# EAGLE board pipistrello_v2 (EAGLE 6.3), part 1 of 2
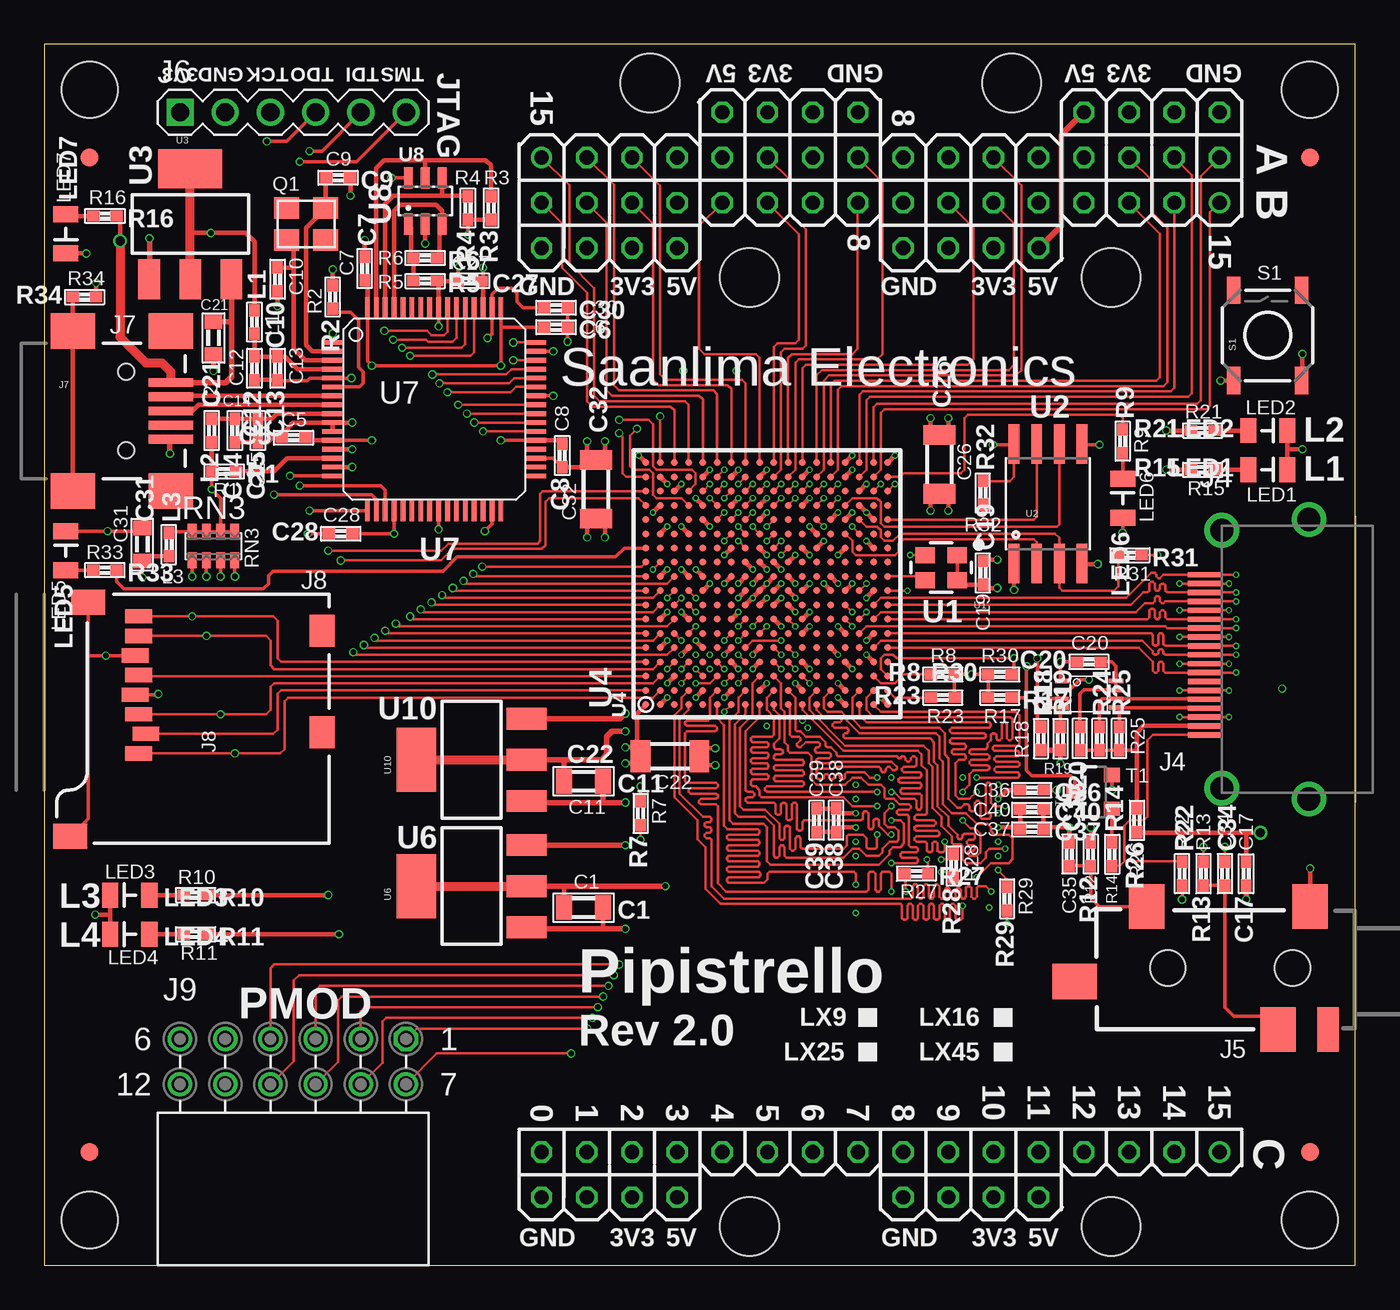
[diagram p5: board, top side]
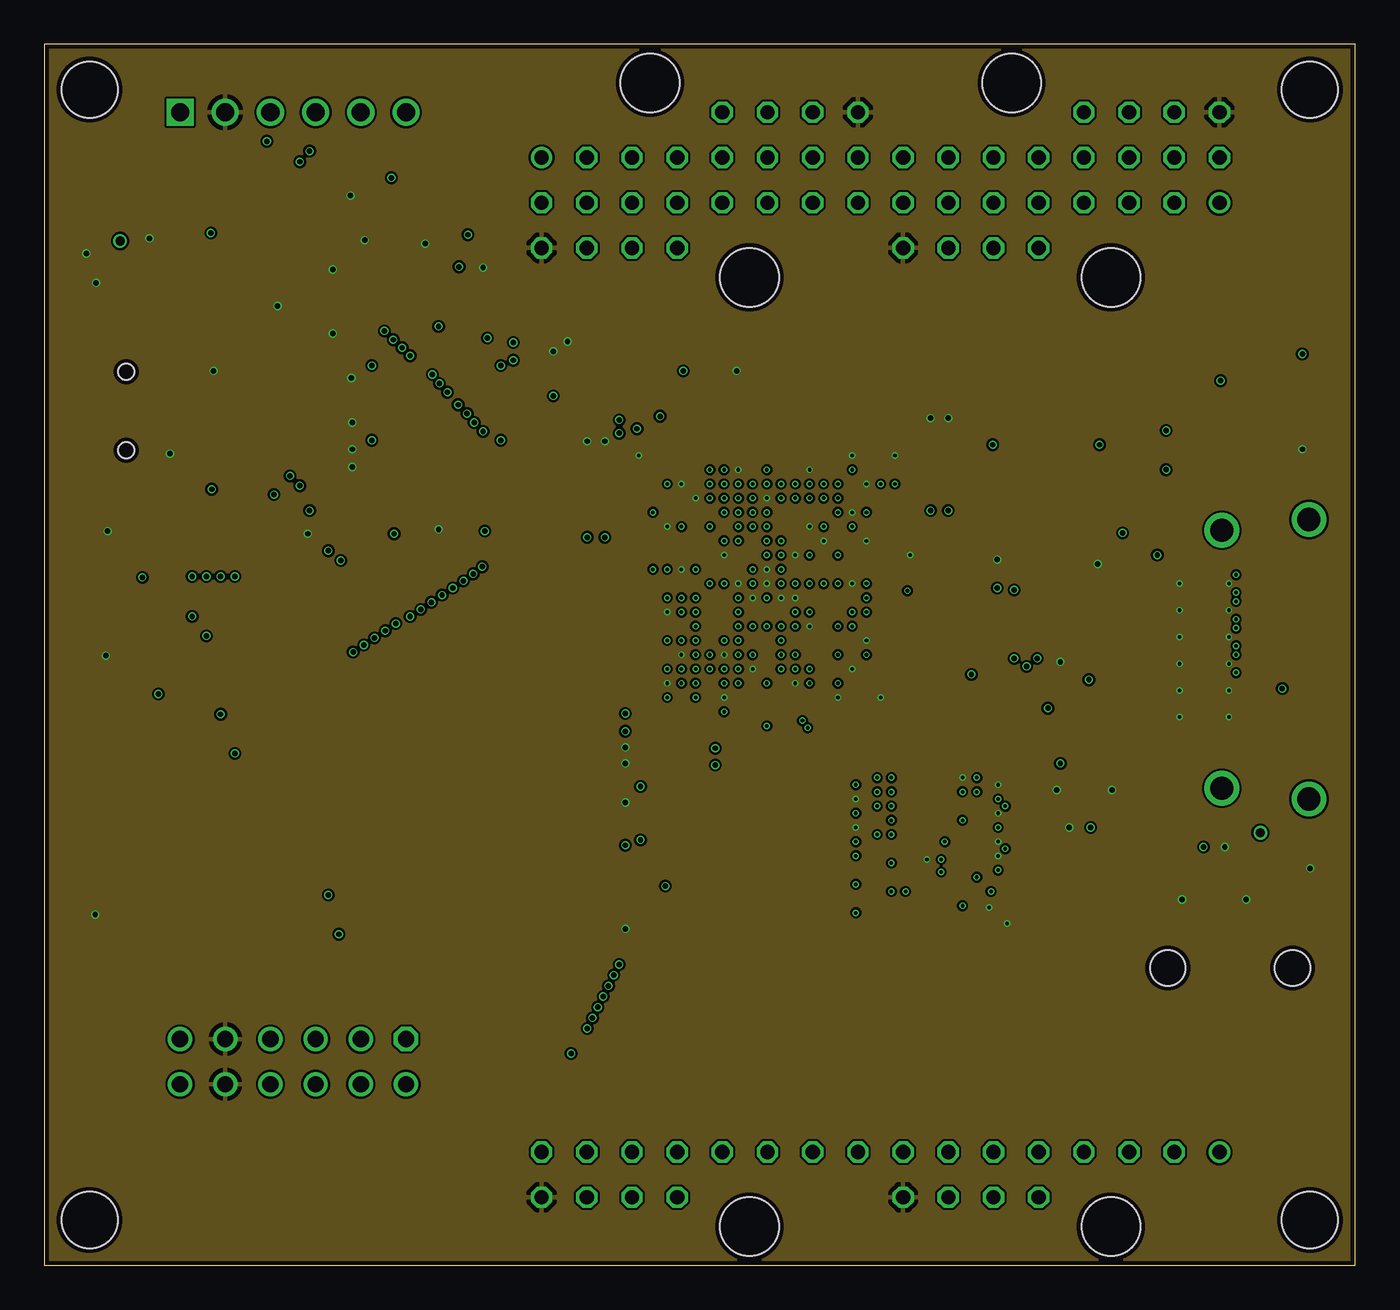
[diagram p6: board, inner layer Route2]
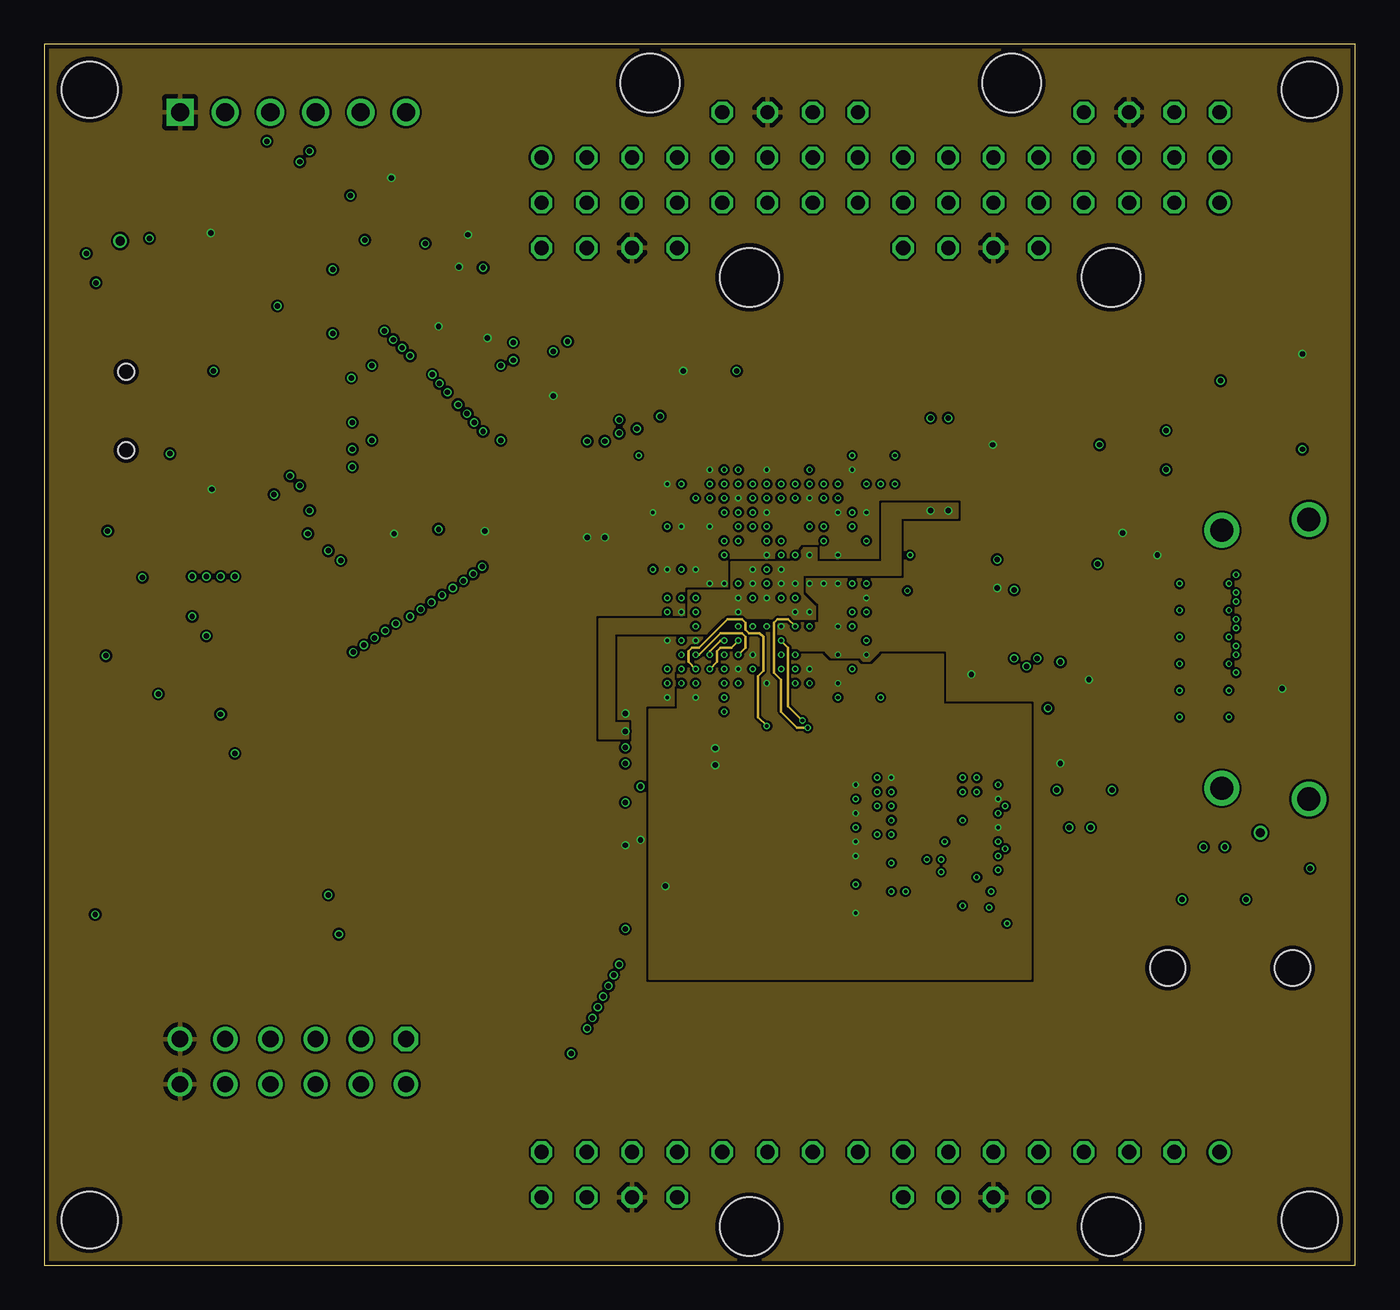
[diagram p7: board, inner layer Route3]
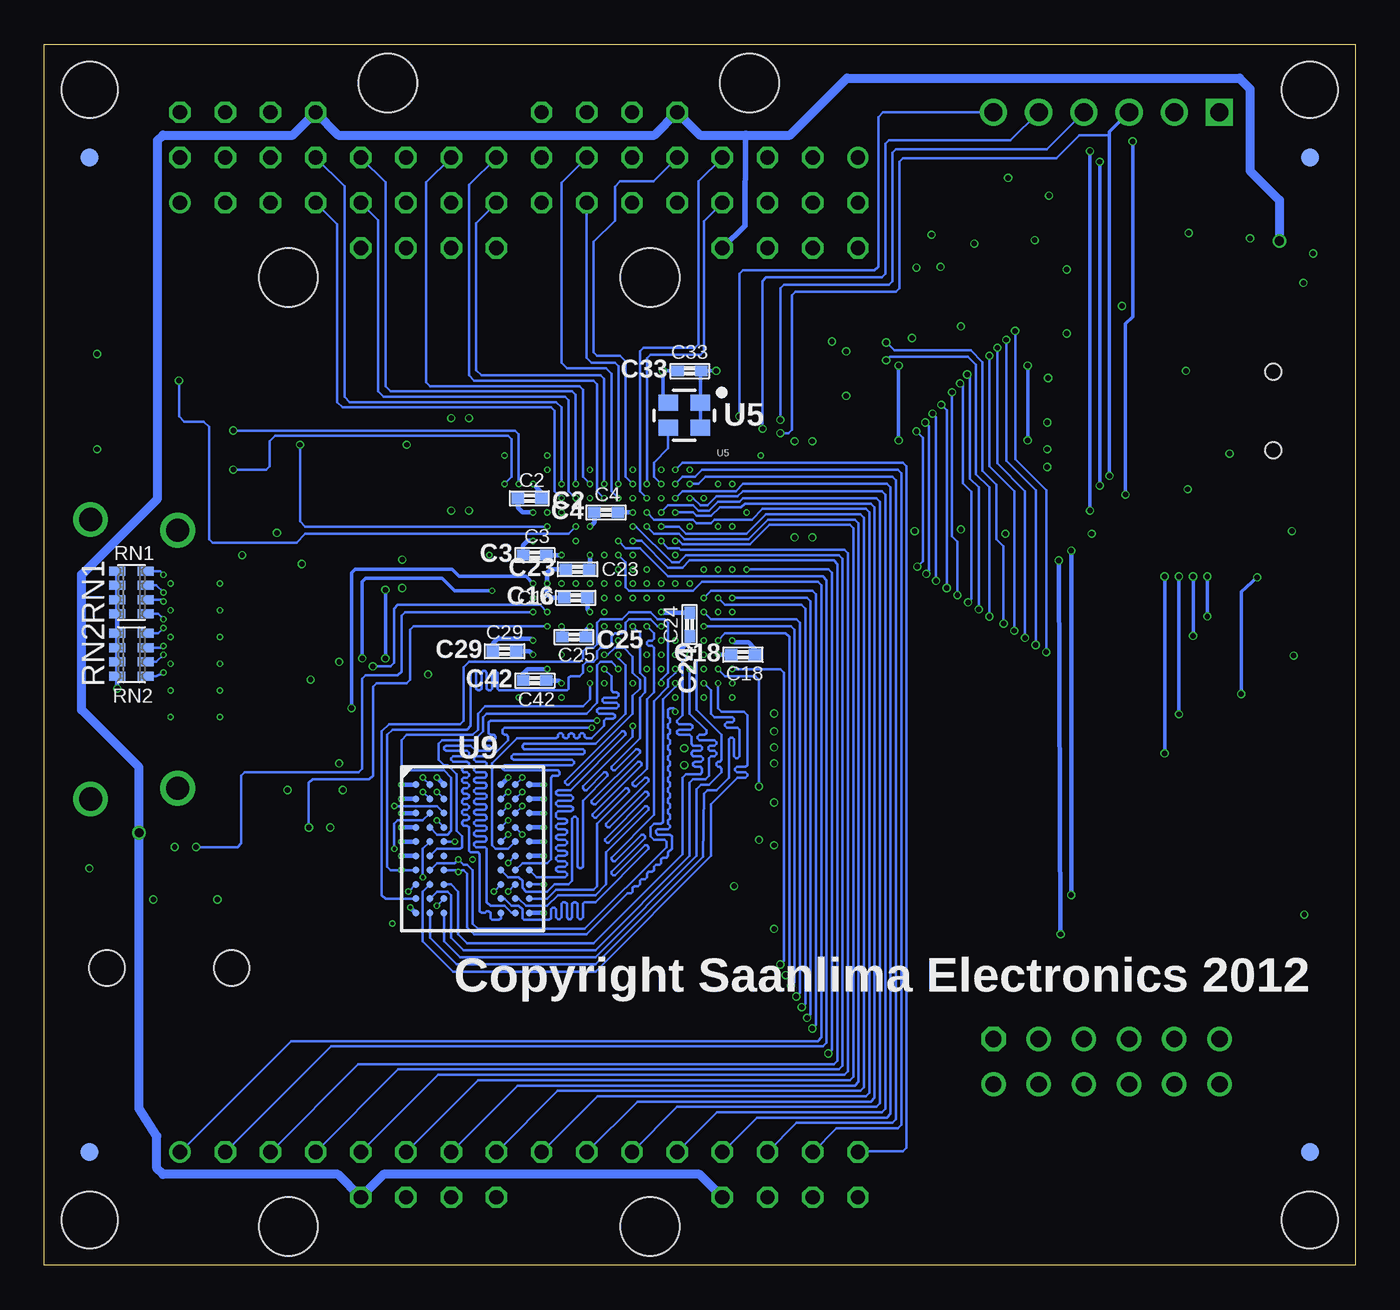
[diagram p8: board, bottom side, seen from below]

Size 73.66 x 68.58 mm. Coordinates in mm from the lower left corner, seen from the top.
Outline: 0,0 73.66,0 73.66,68.58 0,68.58 0,0
Copper layers (1*2+3*16): Top 0.035mm / dielectric 0.2mm / Route2 0.035mm / dielectric 0.05mm / Route3 0.035mm / dielectric 0.2mm / Bottom 0.035mm
Design rules "Fusion_eagle_rule_v1.1 *": minimum track width 5mil, minimum drill 8mil, track to track 5mil, track to pad 5mil, pad to pad 5mil, via to via 5mil, smd to smd 0mil, copper to edge 10mil, drill to drill 10mil, minimum pad ring 4mil, minimum via ring 3mil, stop-mask expansion 2mil, vias tented up to drill 100mil, thermal gap 10mil
Net classes: 1 power: width 0.203 mm
Holes 3.17 mm at 2.54,66.04 2.54,2.54 71.12,2.54 71.12,66.04

## Footprints (pad centres in the part's own frame; a part is rotated, then mirrored left to right if it is on the bottom)
0805 = smd 0.9 x 1.4: 1 -1.1,0; 2 1.1,0
0402 = smd 0.7 x 0.6: 1 -0.655,0; 2 0.655,0
0603 = smd 0.8 x 1: 1 -0.925,0; 2 0.925,0
1206 = smd 1.1 x 1.8: 1 -1.65,0; 2 1.65,0
WING_16BIT = drill 0.8 octagon: 1 1.27,-19.05; 2 1.27,-16.51; 2V5H 3.81,3.81; 2V5L 3.81,-16.51; 3 1.27,-13.97; 3V3H 3.81,6.35; 3V3L 3.81,-13.97; 4 1.27,-11.43; 5 1.27,-8.89; 5VH 3.81,8.89; 5VL 3.81,-11.43; 6 1.27,-6.35; 7 1.27,-3.81; 8 1.27,-1.27; 9 1.27,1.27; 10 1.27,3.81; 11 1.27,6.35; 12 1.27,8.89; 13 1.27,11.43; 14 1.27,13.97; 15 1.27,16.51; GNDH 3.81,1.27; GNDL 3.81,-19.05 | drill 0.8: 16 1.27,19.05 | hole 3.302: 5.461,12.954; 5.461,-7.366
FCI-HDMI-TYPE-A-RECEPT = smd 1.9 x 0.3: 1 -0.95,4.5; 2 -0.95,4; 3 -0.95,3.5; 4 -0.95,3; 5 -0.95,2.5; 6 -0.95,2; 7 -0.95,1.5; 8 -0.95,1; 9 -0.95,0.5; 10 -0.95,0; 11 -0.95,-0.5; 12 -0.95,-1; 13 -0.95,-1.5; 14 -0.95,-2; 15 -0.95,-2.5; 16 -0.95,-3; 17 -0.95,-3.5; 18 -0.95,-4; 19 -0.95,-4.5 | drill 1.3: SH1 4.9,7.6; SH2 0,7; SH3 0,-7.5; SH4 4.9,-8.1
AUDIO-JACK-3.5MM-SMD = smd 2 x 2.5: RING 4.3,3.45; SLEEVE 2.5,-3.45; TIP 11.7,-3.45 | smd 1.2 x 2.5: RSH 1.5,3.45 | smd 2.5 x 2: TSH 15.75,0.75 | hole 2: 3.5,0; 10.5,0
MA06-1 = drill 1.016 square: 1 0,0 | drill 1.016: 2 2.54,0; 3 5.08,0; 4 7.62,0; 5 10.16,0; 6 12.7,0
USB-MINIB = smd 2.5 x 0.5: D+ 2.5,0; D- 2.5,0.8; GND 2.5,-1.6; ID 2.5,-0.8; VBUS 2.5,1.6 | smd 2.5 x 2: MTN1 -3,4.5; MTN2 2.5,4.5; MTN3 -3,-4.5; MTN4 2.5,-4.5 | hole 0.9: 0,2.2; 0,-2.2
MICRO-SD-SOCKET-PP = smd 0.8 x 1.5: 1 -8.94,10.7; 2 -7.84,10.3; 3 -6.74,10.7; 4 -5.64,10.9; 5 -4.54,10.7; 6 -3.44,10.9; 7 -2.34,10.7; 8 -1.24,10.7 | smd 1.8 x 1.4: CD1 -2.05,0.4; CD2 -7.75,0.4 | smd 1.4 x 1.9: GND1 -13.6,14.55; GND3 -0.45,13.55
PMOD = drill 0.914 octagon: 1 6.35,1.27 | drill 0.914: 2 3.81,1.27; 3 1.27,1.27; 4 -1.27,1.27; 5 -3.81,1.27; 6 -6.35,1.27; 7 6.35,-1.27; 8 3.81,-1.27; 9 1.27,-1.27; 10 -1.27,-1.27; 11 -3.81,-1.27; 12 -6.35,-1.27
FIDUCIAL-1X2 = smd 1 x 1: 1 0,0
0805_POL = smd 0.9 x 1.4: + 1.1,0; - -1.1,0
CRYSTAL3.2X2.5MM = smd 1.4 x 1.2: 1 -1.1,-0.9; 2 1.1,-0.9; 3 1.1,0.9; 4 -1.1,0.9
CTS742C083 = smd 0.5 x 0.9: 1 -1.2,-0.8; 2 -0.4,-0.8; 3 0.4,-0.8; 4 1.2,-0.8; 5 1.2,0.8; 6 0.4,0.8; 7 -0.4,0.8; 8 -1.2,0.8
TACTILE_SWITCH_SMD = smd 1.524 x 0.762: 1 -2.54,1.905; 2 2.54,1.905; 3 -2.54,-1.905; 4 2.54,-1.905
SOT23-3 = smd 0.8 x 0.9: 1 -0.95,-1; 2 0.95,-1; 3 0,1.1
CRYSTAL-OSC-SMD-2.5X2 = smd 1.1 x 0.9: 1 -0.9,-0.7; 2 0.9,-0.7; 3 0.9,0.7; 4 -0.9,0.7
SO08-EIAJ = smd 0.61 x 2.21: 1 -1.905,-3.378; 2 -0.635,-3.378; 3 0.635,-3.378; 4 1.905,-3.378; 5 1.905,3.353; 6 0.635,3.353; 7 -0.635,3.353; 8 -1.905,3.353
SOT223 = smd 1.219 x 2.235: 1 -2.311,-3.099; 2 0,-3.099; 3 2.311,-3.099 | smd 3.6 x 2.2: 4 0,3.099
CS324 = smd 0.4 x 0.4: A1 -6.8,6.8; A2 -6,6.8; A3 -5.2,6.8; A4 -4.4,6.8; A5 -3.6,6.8; A6 -2.8,6.8; A7 -2,6.8; A8 -1.2,6.8; A9 -0.4,6.8; A10 0.4,6.8; A11 1.2,6.8; A12 2,6.8; A13 2.8,6.8; A14 3.6,6.8; A15 4.4,6.8; A16 5.2,6.8; A17 6,6.8; A18 6.8,6.8; B1 -6.8,6; B2 -6,6; B3 -5.2,6; B4 -4.4,6; B5 -3.6,6; B6 -2.8,6; B7 -2,6; B8 -1.2,6; B9 -0.4,6; B10 0.4,6; B11 1.2,6; B12 2,6; B13 2.8,6; B14 3.6,6; B15 4.4,6; B16 5.2,6; B17 6,6; B18 6.8,6; C1 -6.8,5.2; C2 -6,5.2; C3 -5.2,5.2; C4 -4.4,5.2; C5 -3.6,5.2; C6 -2.8,5.2; C7 -2,5.2; C8 -1.2,5.2; C9 -0.4,5.2; C10 0.4,5.2; C11 1.2,5.2; C12 2,5.2; C13 2.8,5.2; C14 3.6,5.2; C15 4.4,5.2; C16 5.2,5.2; C17 6,5.2; C18 6.8,5.2; D1 -6.8,4.4; D2 -6,4.4; D3 -5.2,4.4; D4 -4.4,4.4; D5 -3.6,4.4; D6 -2.8,4.4; D7 -2,4.4; D8 -1.2,4.4; D9 -0.4,4.4; D10 0.4,4.4; D11 1.2,4.4; D12 2,4.4; D13 2.8,4.4; D14 3.6,4.4; D15 4.4,4.4; D16 5.2,4.4; D17 6,4.4; D18 6.8,4.4; E1 -6.8,3.6; E2 -6,3.6; E3 -5.2,3.6; E4 -4.4,3.6; E5 -3.6,3.6; E6 -2.8,3.6; E7 -2,3.6; E8 -1.2,3.6; E9 -0.4,3.6; E10 0.4,3.6; E11 1.2,3.6; E12 2,3.6; E13 2.8,3.6; E14 3.6,3.6; E15 4.4,3.6; E16 5.2,3.6; E17 6,3.6; E18 6.8,3.6; F1 -6.8,2.8; F2 -6,2.8; F3 -5.2,2.8; F4 -4.4,2.8; F5 -3.6,2.8; F6 -2.8,2.8; F7 -2,2.8; F8 -1.2,2.8; F9 -0.4,2.8; F10 0.4,2.8; F11 1.2,2.8; F12 2,2.8; F13 2.8,2.8; F14 3.6,2.8; F15 4.4,2.8; F16 5.2,2.8; F17 6,2.8; F18 6.8,2.8; G1 -6.8,2; G2 -6,2; G3 -5.2,2; G4 -4.4,2; G5 -3.6,2; G6 -2.8,2; G7 -2,2; G8 -1.2,2; G9 -0.4,2; G10 0.4,2; G11 1.2,2; G12 2,2; G13 2.8,2; G14 3.6,2; G15 4.4,2; G16 5.2,2; G17 6,2; G18 6.8,2; H1 -6.8,1.2; H2 -6,1.2; H3 -5.2,1.2; H4 -4.4,1.2; H5 -3.6,1.2; H6 -2.8,1.2; H7 -2,1.2; H8 -1.2,1.2; H9 -0.4,1.2; H10 0.4,1.2; H11 1.2,1.2; H12 2,1.2; H13 2.8,1.2; H14 3.6,1.2; H15 4.4,1.2; H16 5.2,1.2; H17 6,1.2; H18 6.8,1.2; J1 -6.8,0.4; J2 -6,0.4; J3 -5.2,0.4; J4 -4.4,0.4; J5 -3.6,0.4; J6 -2.8,0.4; J7 -2,0.4; J8 -1.2,0.4; J9 -0.4,0.4; J10 0.4,0.4; J11 1.2,0.4; J12 2,0.4; J13 2.8,0.4; J14 3.6,0.4; J15 4.4,0.4; J16 5.2,0.4; J17 6,0.4; J18 6.8,0.4; K1 -6.8,-0.4; K2 -6,-0.4; K3 -5.2,-0.4; K4 -4.4,-0.4; K5 -3.6,-0.4; K6 -2.8,-0.4; K7 -2,-0.4; K8 -1.2,-0.4; K9 -0.4,-0.4; K10 0.4,-0.4; K11 1.2,-0.4; K12 2,-0.4; K13 2.8,-0.4; K14 3.6,-0.4; K15 4.4,-0.4; K16 5.2,-0.4; K17 6,-0.4; K18 6.8,-0.4; L1 -6.8,-1.2; L2 -6,-1.2; L3 -5.2,-1.2; L4 -4.4,-1.2; L5 -3.6,-1.2; L6 -2.8,-1.2; L7 -2,-1.2; L8 -1.2,-1.2; L9 -0.4,-1.2; L10 0.4,-1.2; L11 1.2,-1.2; L12 2,-1.2; L13 2.8,-1.2; L14 3.6,-1.2; L15 4.4,-1.2; L16 5.2,-1.2; L17 6,-1.2; L18 6.8,-1.2; M1 -6.8,-2; M2 -6,-2; M3 -5.2,-2; M4 -4.4,-2; M5 -3.6,-2; M6 -2.8,-2; M7 -2,-2; M8 -1.2,-2; M9 -0.4,-2; M10 0.4,-2; M11 1.2,-2; M12 2,-2; M13 2.8,-2; M14 3.6,-2; M15 4.4,-2; M16 5.2,-2; M17 6,-2; M18 6.8,-2; N1 -6.8,-2.8; N2 -6,-2.8; N3 -5.2,-2.8; N4 -4.4,-2.8; N5 -3.6,-2.8; N6 -2.8,-2.8; N7 -2,-2.8; N8 -1.2,-2.8; N9 -0.4,-2.8; N10 0.4,-2.8; N11 1.2,-2.8; N12 2,-2.8; N13 2.8,-2.8; N14 3.6,-2.8; N15 4.4,-2.8; N16 5.2,-2.8; N17 6,-2.8; N18 6.8,-2.8; P1 -6.8,-3.6; P2 -6,-3.6; P3 -5.2,-3.6; P4 -4.4,-3.6; P5 -3.6,-3.6; P6 -2.8,-3.6; P7 -2,-3.6; P8 -1.2,-3.6; P9 -0.4,-3.6; P10 0.4,-3.6; P11 1.2,-3.6; P12 2,-3.6; P13 2.8,-3.6; P14 3.6,-3.6; P15 4.4,-3.6; P16 5.2,-3.6; P17 6,-3.6; P18 6.8,-3.6; R1 -6.8,-4.4; R2 -6,-4.4; R3 -5.2,-4.4; R4 -4.4,-4.4; R5 -3.6,-4.4; R6 -2.8,-4.4; R7 -2,-4.4; R8 -1.2,-4.4; R9 -0.4,-4.4; R10 0.4,-4.4; R11 1.2,-4.4; R12 2,-4.4; R13 2.8,-4.4; R14 3.6,-4.4; R15 4.4,-4.4; R16 5.2,-4.4; R17 6,-4.4; R18 6.8,-4.4; T1 -6.8,-5.2; T2 -6,-5.2; T3 -5.2,-5.2; T4 -4.4,-5.2; T5 -3.6,-5.2; T6 -2.8,-5.2; T7 -2,-5.2; T8 -1.2,-5.2; T9 -0.4,-5.2; T10 0.4,-5.2; T11 1.2,-5.2; T12 2,-5.2; T13 2.8,-5.2; T14 3.6,-5.2; T15 4.4,-5.2; T16 5.2,-5.2; T17 6,-5.2; T18 6.8,-5.2; U1 -6.8,-6; U2 -6,-6; U3 -5.2,-6; U4 -4.4,-6; U5 -3.6,-6; U6 -2.8,-6; U7 -2,-6; U8 -1.2,-6; U9 -0.4,-6; U10 0.4,-6; U11 1.2,-6; U12 2,-6; U13 2.8,-6; U14 3.6,-6; U15 4.4,-6; U16 5.2,-6; U17 6,-6; U18 6.8,-6; V1 -6.8,-6.8; V2 -6,-6.8; V3 -5.2,-6.8; V4 -4.4,-6.8; V5 -3.6,-6.8; V6 -2.8,-6.8; V7 -2,-6.8; V8 -1.2,-6.8; V9 -0.4,-6.8; V10 0.4,-6.8; V11 1.2,-6.8; V12 2,-6.8; V13 2.8,-6.8; V14 3.6,-6.8; V15 4.4,-6.8; V16 5.2,-6.8; V17 6,-6.8; V18 6.8,-6.8
LQFP64 = smd 1.2 x 0.27: 1 -5.7,3.75; 2 -5.7,3.25; 3 -5.7,2.75; 4 -5.7,2.25; 5 -5.7,1.75; 6 -5.7,1.25; 7 -5.7,0.75; 8 -5.7,0.25; 9 -5.7,-0.25; 10 -5.7,-0.75; 11 -5.7,-1.25; 12 -5.7,-1.75; 13 -5.7,-2.25; 14 -5.7,-2.75; 15 -5.7,-3.25; 16 -5.7,-3.75; 33 5.7,-3.75; 34 5.7,-3.25; 35 5.7,-2.75; 36 5.7,-2.25; 37 5.7,-1.75; 38 5.7,-1.25; 39 5.7,-0.75; 40 5.7,-0.25; 41 5.7,0.25; 42 5.7,0.75; 43 5.7,1.25; 44 5.7,1.75; 45 5.7,2.25; 46 5.7,2.75; 47 5.7,3.25; 48 5.7,3.75 | smd 0.27 x 1.2: 17 -3.75,-5.7; 18 -3.25,-5.7; 19 -2.75,-5.7; 20 -2.25,-5.7; 21 -1.75,-5.7; 22 -1.25,-5.7; 23 -0.75,-5.7; 24 -0.25,-5.7; 25 0.25,-5.7; 26 0.75,-5.7; 27 1.25,-5.7; 28 1.75,-5.7; 29 2.25,-5.7; 30 2.75,-5.7; 31 3.25,-5.7; 32 3.75,-5.7; 49 3.75,5.7; 50 3.25,5.7; 51 2.75,5.7; 52 2.25,5.7; 53 1.75,5.7; 54 1.25,5.7; 55 0.75,5.7; 56 0.25,5.7; 57 -0.25,5.7; 58 -0.75,5.7; 59 -1.25,5.7; 60 -1.75,5.7; 61 -2.25,5.7; 62 -2.75,5.7; 63 -3.25,5.7; 64 -3.75,5.7
SOT23-6 = smd 0.55 x 1.2: 1 -0.95,-1.3; 2 0,-1.3; 3 0.95,-1.3; 4 0.95,1.3; 5 0,1.3; 6 -0.95,1.3
FBFA60-6X10 = smd 0.4 x 0.4: A1 -3.2,3.6; A2 -2.4,3.6; A3 -1.6,3.6; A7 1.6,3.6; A8 2.4,3.6; A9 3.2,3.6; B1 -3.2,2.8; B2 -2.4,2.8; B3 -1.6,2.8; B7 1.6,2.8; B8 2.4,2.8; B9 3.2,2.8; C1 -3.2,2; C2 -2.4,2; C3 -1.6,2; C7 1.6,2; C8 2.4,2; C9 3.2,2; D1 -3.2,1.2; D2 -2.4,1.2; D3 -1.6,1.2; D7 1.6,1.2; D8 2.4,1.2; D9 3.2,1.2; E1 -3.2,0.4; E2 -2.4,0.4; E3 -1.6,0.4; E7 1.6,0.4; E8 2.4,0.4; E9 3.2,0.4; F1 -3.2,-0.4; F2 -2.4,-0.4; F3 -1.6,-0.4; F7 1.6,-0.4; F8 2.4,-0.4; F9 3.2,-0.4; G1 -3.2,-1.2; G2 -2.4,-1.2; G3 -1.6,-1.2; G7 1.6,-1.2; G8 2.4,-1.2; G9 3.2,-1.2; H1 -3.2,-2; H2 -2.4,-2; H3 -1.6,-2; H7 1.6,-2; H8 2.4,-2; H9 3.2,-2; J1 -3.2,-2.8; J2 -2.4,-2.8; J3 -1.6,-2.8; J7 1.6,-2.8; J8 2.4,-2.8; J9 3.2,-2.8; K1 -3.2,-3.6; K2 -2.4,-3.6; K3 -1.6,-3.6; K7 1.6,-3.6; K8 2.4,-3.6; K9 3.2,-3.6
PSOP-8 = smd 0.25 x 0.8: 1 -0.73,-1.52; 2 -0.23,-1.52; 3 0.27,-1.52; 4 0.77,-1.52; 5 0.77,1.53; 6 0.27,1.53; 7 -0.23,1.53; 8 -0.73,1.53

## Placement (x,y rotation side)
C1  10uF  [0805]  30.3,20.09 0 top
C2  .1uF  [0402]  46.4,43.09 0 bottom
C3  .1uF  [0402]  46.1,39.89 180 bottom
C4  4.7uF  [0402]  42.1,42.29 180 bottom
C5  4.7uF  [0402]  14,46.49 180 top
C6  .1uF  [0402]  28.75,52.69 0 top
C7  .1uF  [0402]  18,55.99 90 top
C8  .1uF  [0402]  29.1,45.49 270 top
C9  27pF  [0402]  16.5,61.09 0 top
C10  27pF  [0402]  13.1,55.39 270 top
C11  10uF  [0805]  30.3,27.19 0 top
C12  4.7uF  [0402]  11.8,50.39 270 top
C13  .1uF  [0402]  13.1,50.39 270 top
C14  4.7uF  [0402]  10.7,46.89 270 top
C15  .1uF  [0402]  12,46.89 270 top
C16  4.7uF  [0402]  43.8,37.49 180 bottom
C17  4.7uF  [0402]  67.54,21.99 270 top
C18  .1uF  [0402]  34.4,34.29 180 bottom
C19  .1uF  [0402]  52.75,38.89 90 top
C20  1uF  [0402]  58.7,33.89 180 top
C21  10uF  [0603]  9.5,52.09 270 top
C22  100uF  [1206]  35.15,28.59 180 top
C23  .1uF  [0402]  43.7,39.09 180 bottom
C24  .1uF  [0402]  37.4,35.99 270 bottom
C25  .1uF  [0402]  43.9,35.29 0 bottom
C26  100uF  [1206]  50.3,44.99 90 top
C27  .1uF  [0402]  23.9,55.29 0 top
C28  .1uF  [0402]  16.65,41.09 180 top
C29  .1uF  [0402]  47.8,34.49 180 bottom
C30  4.7uF  [0402]  28.75,53.79 0 top
C31  10uF  [0603]  5.5,40.49 90 top
C32  100uF  [1206]  31,43.59 90 top
C33  .1uF  [0402]  37.4,50.24 180 bottom
C34  4700pF  [0402]  66.34,21.99 90 top
C35  4700pf  [0402]  57.6,23.09 90 top
C36  4.7uF  [0402]  55.5,26.69 0 top
C37  4.7uF  [0402]  55.5,24.49 0 top
C38  4.7uF  [0402]  44.5,24.99 270 top
C39  .1uF  [0402]  43.4,24.99 270 top
C40  .1uF  [0402]  55.5,25.59 0 top
C42  .1uF  [0402]  46.1,32.84 180 bottom
J1  WING_16BIT  [WING_16BIT]  46.99,60.96 90 top
J2  WING_16BIT  [WING_16BIT]  46.99,60.96 270 top
J3  WING_16BIT  [WING_16BIT]  46.99,7.62 270 top
J4  HDMI-TYPE-A-RECEPTICALFCI10029449  [FCI-HDMI-TYPE-A-RECEPT]  66.17,34.29 0 top
J5  AUDIO-JACK2SMD  [AUDIO-JACK-3.5MM-SMD]  73.64,16.69 180 top
J6  [MA06-1]  7.62,64.77 0 top
J7  USB-MINIB-5PIN  [USB-MINIB]  4.6,47.99 0 top
J8  USD-SOCKET  [MICRO-SD-SOCKET-PP]  16,37.69 90 top
J9  PMOD  [PMOD]  13.97,11.43 0 top
JP1  FIDUCIAL1X2  [FIDUCIAL-1X2]  2.54,62.23 0 top
JP2  FIDUCIAL1X2  [FIDUCIAL-1X2]  2.54,62.23 0 bottom
JP3  FIDUCIAL1X2  [FIDUCIAL-1X2]  71.12,6.35 0 top
JP4  FIDUCIAL1X2  [FIDUCIAL-1X2]  71.12,6.35 0 bottom
JP5  FIDUCIAL1X2  [FIDUCIAL-1X2]  2.54,6.35 0 top
JP6  FIDUCIAL1X2  [FIDUCIAL-1X2]  2.54,6.35 0 bottom
JP7  FIDUCIAL1X2  [FIDUCIAL-1X2]  71.12,62.23 0 top
JP8  FIDUCIAL1X2  [FIDUCIAL-1X2]  71.12,62.23 0 bottom
L1  [0402]  11.8,52.99 90 top
L2  [0402]  9.4,46.89 270 top
L3  [0402]  7,40.49 90 top
LED1  LED GREEN  [0805_POL]  68.75,44.69 180 top
LED2  LED RED  [0805_POL]  68.75,46.89 180 top
LED3  LED GREEN  [0805_POL]  4.8,20.79 0 top
LED4  LED RED  [0805_POL]  4.8,18.59 0 top
LED5  LED RED  [0805_POL]  1.2,40.14 270 top
LED6  LED YELLOW  [0805_POL]  60.6,43.09 270 top
LED7  LED GREEN  [0805_POL]  1.2,57.94 90 top
Q1  12MHz  [CRYSTAL3.2X2.5MM]  14.7,58.49 180 top
R1  10K  [0402]  10.1,44.59 0 top
R2  12K  [0402]  16.2,54.39 270 top
R3  10K  [0402]  25.1,59.39 270 top
R4  10K  [0402]  23.8,59.39 270 top
R5  10K  [0402]  21.4,55.29 0 top
R6  2.2K  [0402]  21.4,56.59 0 top
R7  4.7K  [0402]  33.5,25.39 270 top
R8  4.7K  [0402]  50.5,33.19 180 top
R9  1K  [0402]  60.6,46.29 90 top
R10  1K  [0402]  8.5,20.79 0 top
R11  1K  [0402]  8.5,18.59 0 top
R12  3.3K  [0402]  58.8,23.09 270 top
R13  3.3K  [0402]  65.14,21.99 270 top
R14  10K  [0402]  60,23.09 90 top
R15  1K  [0402]  65.1,44.69 180 top
R16  1K  [0402]  3.4,58.94 0 top
R17  2.2K  [0402]  53.7,31.89 0 top
R18  1K  [0402]  56,29.59 90 top
R19  1K  [0402]  57.1,29.59 90 top
R20  100K  [0402]  58.2,29.59 270 top
R21  1K  [0402]  65.1,46.89 180 top
R22  10K  [0402]  63.94,21.99 90 top
R23  4.7K  [0402]  50.5,31.89 180 top
R24  1K  [0402]  59.3,29.59 90 top
R25  1K  [0402]  60.4,29.59 90 top
R26  0  [0402]  61.4,24.99 270 top
R27  100  [0402]  49,21.99 0 top
R28  100  [0402]  51.1,22.44 270 top
R29  4.7K  [0402]  54.1,20.59 270 top
R30  4.7K  [0402]  53.7,33.19 180 top
R31  100K  [0402]  61,39.89 0 top
R32  100K  [0402]  52.75,43.39 90 top
R33  1K  [0402]  3.4,39.04 0 top
R34  100K  [0402]  2.25,54.39 180 top
RN1  51  [CTS742C083]  68.77,37.79 90 bottom
RN2  51  [CTS742C083]  68.77,34.29 90 bottom
RN3  51  [CTS742C083]  9.5,40.39 0 top
S1  SWITCH-MOMENTARY-2SMD  [TACTILE_SWITCH_SMD]  68.75,52.24 90 top
T1  MOSFET-NCHANNELSMD  [SOT23-3]  59,26.59 90 top
U1  OSCILLATOR2.5X2  [CRYSTAL-OSC-SMD-2.5X2]  50.4,39.19 180 top
U2  FLASH-SPI-25XXSMD1  [SO08-EIAJ]  56.4,42.79 0 top
U3  [SOT223]  8.2,58.49 0 top
U4  6SLX9CSG324  [CS324]  40.6,38.29 90 top
U5  OSCILLATOR2.5X2  [CRYSTAL-OSC-SMD-2.5X2]  37.7,47.74 180 bottom
U6  [SOT223]  24,21.29 90 top
U7  [LQFP64]  21.9,48.09 0 top
U8  93C46B  [SOT23-6]  21.4,59.79 0 top
U9  MT46H32M16LF  [FBFA60-6X10]  49.6,23.39 0 bottom
U10  [SOT223]  24,28.39 90 top
U11  PCA9306  [PSOP-8]  58.7,32.09 270 top

## Tracks (layer width: path | path; a pad name or v marks a point on that pad's centre or on a via)
1V2  (via drill 0.2, 0.3)
  Top 0.254: v43,39.89 U4.M12 | v39.8,39.09 U4.H11 | U4.J10 v39.8,38.29 | U4.H9 v39,37.49 | U4.J8 v40.6,37.49 | v42.2,36.69 U4.L8 | U4.M7 v43,36.69 | U4.L10 v42.2,38.29 | U4.K9 v41.4,38.29 | v41.4,39.09 U4.K11 | v39,36.69 U4.G7 | v49.8,42.39 49.8,43.24 C26.1 50.8,43.24 v50.8,42.39
  Top 0.305: U10.2 29.2,28.39 | 29.2,28.39 31.3,28.39 31.6,28.69 31.6,29.69 31.9,29.99 v32.65,29.99 | 29.2,28.39 C11.1
  Top 0.508: U10.4 U10.2
  Bottom 0.254: C23.1 43,39.13 v43,39.89 | C24.1 38.95,36.65 v39,36.69 | C16.1 43.15,36.84 v43,36.69
  pour Route3 (isolate 0.127): 38.2,36.39 38.1,36.39 37.2,35.49 32,35.49 32,30.44 32.8,30.44 32.8,29.59 31.2,29.59 31.2,36.29 36.2,36.29 36.2,37.89 38.6,37.89 38.6,39.49 41.9,39.49 42.7,40.29 43.4,40.29 43.4,39.49 47.1,39.49 47.1,42.79 51.3,42.79 51.3,41.99 48.1,41.99 48.1,38.79 42.6,38.79 42.6,37.69 43.3,36.99 43.3,36.29
1V8  (via drill 0.2, 0.3)
  Top 0.254: v44.6,32.69 U4.R2 | U4.M4 v43,33.49 | U4.J5 v39.8,34.29 | U4.J2 v40.6,32.69 | U4.G4 v39,33.49 | U4.E2 v36.6,31.89 | v37.7,29.04 36.85,29.04 C22.1 36.85,28.09 v37.7,28.09 | v53.6,26.19 54.1,26.69 C36.1 | v53.6,24.59 54.84,24.59 C37.1 C40.1 | v45.6,25.39 44.66,25.39 C38.1 C39.1 | 29.2,21.29 C1.1
  Top 0.305: U6.2 29.2,21.29 v34.9,21.29
  Top 0.508: U6.4 U6.2
  Bottom 0.254: U9.B1 v53.6,26.19 | U9.D1 v53.6,24.59 | U9.A7 v47.6,27.39 | v45.6,26.99 U9.A9 | v45.6,25.39 U9.C9 | v45.6,23.79 U9.E9 | v45.6,22.99 U9.F9 | v45.6,19.79 U9.K9 | C42.1 44.75,32.84 v44.6,32.69
  pour Route3 (isolate 0.127): 34,31.19 35.6,31.19 35.6,33.79 36.3,34.49 37,34.49 38,35.49 41.2,35.49 42.4,34.29 43.7,34.29 44.1,33.89 45.7,33.89 45.9,33.69 46.5,33.69 47.1,34.29 50.5,34.29 50.5,31.49 55.4,31.49 55.4,16.09 34,16.09
3V3  (via drill 0.2, 0.3)
  Top 0.127: v33.5,23.89 R7.2 | R31.2 v62.55,39.89
  Top 0.152: U2.8 54.5,46.04 54.5,44.29 54.26,44.05 R32.2
  Top 0.203: R23.1 R8.1 v52.1,33.19 R30.2 R17.1 | U1.4 U1.1 | R1.1 9.4,44.55 v9.4,43.59 9.9,43.09 RN3.6 | v19.5,61.09 U8.6 | R4.2 v23.8,57.89 | C27.1 23.25,56.03 v23.3,56.09 | U7.56 v22.15,52.74 | v24.9,52.09 25.15,52.34 U7.50 25.15,54.54 25.5,54.89 26.25,54.89 26.55,54.59 26.55,54.14 26.9,53.79 C30.1 | U7.42 v28.6,48.84 | U7.31 25.15,41.64 v24.75,41.24 | U7.20 v19.65,41.09 C28.1 | U11.2 57.63,32.32 58.2,32.89 v58.7,32.89 | 54.5,46.04 54.45,46.09 v53.3,46.09 | v60.6,41.14 LED6.+ | L3.2 7.04,41.19 RN3.8 RN3.7 RN3.6 | RN3.6 RN3.5
  Top 0.254: R3.2 R4.2 | C27.1 R5.2 22.15,55.18 U7.56 | L1.2 11.84,53.59 | L1.2 11.84,53.62 | U4.K7 v41.4,35.89 | U4.E5 v36.6,35.09 | 8.2,57.99 v9.35,57.99 11.3,57.99 11.8,57.49 L1.2 | U4.U14 v46.2,42.29 U4.T15 | L2.2 9.4,44.63 R1.1 | U4.B1 v35,31.89 | v35,35.09 U4.B5 | U4.D7 v35.8,36.69 | U4.U4 v46.2,34.29 | v44.6,35.89 U4.R6 | U4.B10 v35,39.09 | U4.E10 v36.6,39.09 | U4.J17 v40.6,44.69 | U4.G15 v39,43.09 | U4.J14 v40.6,42.29 | U4.J12 v40.6,39.89 | U4.G10 v38.2,38.29 | U4.M15 v43,43.09 | U4.P14 v44.6,42.29 | U4.R17 v45.4,44.69 | U4.E14 v37.4,41.49 | U4.B15 v34.2,42.29 | U4.B17 v35,43.89 | U4.E17 v37.4,44.69 | v44.6,39.89 U4.R12 | U4.U9 v46.2,37.49 | U4.M9 v43,38.29 | U4.P10 v44.6,38.29 | v30.5,40.89 30.5,41.84 C32.1 31.5,41.84 v31.5,40.89 | U4.D13 v35.8,41.49 | U4.E9 v37.4,38.29 | U4.P9 v43.8,38.29 | U4.P5 v44.6,34.29 | R19.1 v57.1,28.19 | U1.4 51.45,38.23 C19.1 52.95,38.04 v53.55,38.04 | S1.3 70.7,49.84 v70.7,51.19
  Top 0.305: U10.3 32.36,30.7 v32.65,30.99 | U6.3 27.31,23.59 v32.65,23.59 | R18.1 R19.1
  Top 0.508: U3.2 8.2,57.99 U3.4
  Bottom 0.203: U5.4 U5.1 36.8,50.24 C33.1 v35.9,50.24
  Bottom 0.254: RN1.5 RN1.6 RN1.7 RN1.8 RN2.5 RN2.6 RN2.7 RN2.8 v69.57,32.39 | v40.6,42.29 C4.1 | C29.1 46.4,34.49 v46.2,34.29 | C2.1 47.05,42.55 46.8,42.29 v46.2,42.29 | C3.1 v44.6,39.89 | C18.1 33.74,34.63 34.1,34.99 34.9,34.99 v35,35.09 | C25.1 44.55,35.84 v44.6,35.89
  pour Route3 (rank 2): 0,0 0,68.58 73.66,68.58 73.66,0
5V  (via drill 0.51)
  Top 0.203: 10.53,55.48 U3.3
  Top 0.254: 67.49,22.57 C17.1 67.54,24.29 | J7.VBUS 7.03,49.58 | U3.3 10.53,55.49 | R26.2 61.45,24.29 67.54,24.29 | v68.34,24.29 67.54,24.29 | R16.2 4.25,58.73 v4.25,57.54
  Top 0.305: 7.03,49.58 10.19,49.58 10.53,49.91 10.53,53.02 | 10.53,53.02 10.53,55.48 | 10.53,53.02 C21.1 | J1.5VL 57.15,63.5 57.15,58.39 55.91,57.15 J2.5VH
  Top 0.508: J7.VBUS 7.1,50.19 6.6,50.69 5.7,50.69 4.25,52.14 v4.25,57.54
  Bottom 0.305: J2.5VL 34.3,58.41 34.25,63.49 | J1.5VL
  Bottom 0.508: J1.5VL 57.15,63.49 39.38,63.49 J1.5VH 36.82,63.49 34.25,63.49 31.75,63.49 28.55,66.69 6.5,66.69 5.9,66.09 5.9,61.49 4.25,59.84 v4.25,57.54 | J3.5VL 36.84,5.09 54.6,5.09 J3.5VH 57.16,5.09 67,5.09 67.35,5.44 67.35,7.24 68.34,8.79 v68.34,24.29 68.34,27.96 71.57,31.19 71.57,38.79 67.3,43.06 67.3,63.19 67,63.49 59.7,63.49 J1.5VL
AUDIO1  (via drill 0.2, 0.3)
  Top 0.127: U4.R7 v45.4,35.89
  Top 0.203: v58.8,24.59 R12.1
  Bottom 0.127: v45.4,35.89 52.9,35.89 53.1,35.69 53.1,32.89 53.3,32.69 55,32.69 55.2,32.49 55.2,27.49 55.4,27.29 58.6,27.29 58.8,27.09 v58.8,24.59
AUDIO2  (via drill 0.2, 0.3)
  Top 0.127: U4.T7 v46.2,36.69 | v65.14,23.49 R13.1
  Bottom 0.127: v46.2,36.69 53.4,36.69 53.6,36.49 53.6,33.34 53.8,33.14 55.6,33.14 55.8,32.94 55.8,27.89 56,27.69 62.4,27.69 62.6,27.49 62.6,23.69 62.8,23.49 v65.14,23.49
CLK
  Top 0.127: J8.5 5.36,33.15 5.5,33.09 U4.A3
CMD  (via drill 0.3)
  Top 0.127: J8.3 v9.9,30.95 12.46,30.95 12.7,31.19 12.7,32.49 12.9,32.69 34.2,32.69 U4.B3
  Top 0.203: v9.9,38.69 RN3.3
  Bottom 0.203: v9.9,30.95 v9.9,38.69
D0  (via drill 0.3)
  Top 0.127: v24.6,39.24 33.55,39.24 U4.A11 | v24.65,46.84 U7.38
  Bottom 0.127: v24.6,39.24 24.3,39.54 24.3,46.49 v24.65,46.84
D1  (via drill 0.3)
  Top 0.127: U4.A10 24.25,38.69 v24.1,38.84 | v24.15,47.34 U7.39
  Bottom 0.127: v24.1,38.84 23.95,38.99 23.95,47.14 v24.15,47.34
D2  (via drill 0.3)
  Top 0.127: U4.C10 35,38.29 23.7,38.29 v23.55,38.44 | v23.75,47.84 U7.40
  Bottom 0.127: v23.55,38.44 23.55,47.64 v23.75,47.84
D3  (via drill 0.3)
  Top 0.127: U4.A9 23.1,37.89 v22.95,38.04 | v23.25,48.34 U7.41
  Bottom 0.127: v22.95,38.04 22.95,48.04 v23.25,48.34
D4  (via drill 0.3)
  Top 0.127: U4.B9 34.2,37.49 22.5,37.49 v22.35,37.64 | v22.65,49.04 26.2,49.04 26.5,49.34 U7.43
  Bottom 0.127: v22.35,37.64 22.35,40.64 22.65,40.94 v22.65,49.04
D5  (via drill 0.3)
  Top 0.127: U4.A8 21.9,37.09 v21.75,37.24 | v22.2,49.54 26.1,49.54 26.4,49.84 U7.44
  Bottom 0.127: v21.75,37.24 21.55,37.44 21.55,43.44 22.05,43.94 22.05,49.39 v22.2,49.54
D6  (via drill 0.3)
  Top 0.127: U4.B8 34.2,36.69 21.3,36.69 v21.15,36.84 | v21.8,50.04 25.95,50.04 26.25,50.34 U7.45
  Bottom 0.127: v21.15,36.84 21.15,43.69 21.65,44.19 21.65,49.89 v21.8,50.04
D7  (via drill 0.3)
  Top 0.127: U4.A7 20.7,36.29 v20.55,36.44 | v26.35,50.84 U7.46
  Bottom 0.127: v20.55,36.44 20.55,43.69 21.3,44.44 21.3,50.59 21.75,51.04 26.15,51.04 v26.35,50.84
DAT0  (via drill 0.3)
  Top 0.127: J8.7 v9.1,35.35 12.46,35.35 12.7,35.09 12.7,33.69 12.9,33.49 34.2,33.49 U4.B4
  Top 0.203: v9.1,38.69 RN3.2
  Bottom 0.203: v9.1,35.35 v9.1,38.69
DAT1  (via drill 0.3)
  Top 0.127: J8.8 v8.3,36.45 12.86,36.45 13.1,36.19 13.1,34.09 13.3,33.89 U4.A4
  Top 0.203: v8.3,38.69 RN3.1
  Top 0.254: J8.8 5.43,36.56
  Bottom 0.203: v8.3,36.45 v8.3,38.69
DAT2  (via drill 0.3)
  Top 0.127: J8.1 v10.7,28.75 13.26,28.75 13.5,28.99 13.5,31.69 13.7,31.89 34.2,31.89 U4.B2
  Top 0.203: v10.7,38.69 RN3.4
  Bottom 0.203: v10.7,28.75 v10.7,38.69
DAT3
  Top 0.127: J8.2 12.86,29.85 13.1,30.09 13.1,32.09 13.3,32.29 U4.A2
DDC_SCL
  Top 0.127: 65.39,31.82 J4.15
  Top 0.203: 65.39,31.82 U11.6 59.43,31.82 59.3,31.69 R24.2
DDC_SDA
  Top 0.127: 65.39,31.32 J4.16
  Top 0.203: 65.39,31.32 U11.5 60.4,31.32 R25.2
DETECT
  Top 0.152: R14.1 60.45,22.43 60.7,22.69 | 60.7,22.69 60.7,24.69 61,24.99 61.8,24.99 62,25.19 62,29.49 62.3,29.79 J4.19 | 60.7,22.69 63.9,22.69
  Top 0.178: 63.9,22.69 R22.2
DONE
  Top 0.127: U4.V17 48.1,44.29 48.3,44.49 51.5,44.49 51.7,44.69 51.7,47.59 51.9,47.79 60.4,47.79 60.6,47.59 R9.2
  Top 0.203: R9.2 60.65,46.99
EECLK
  Top 0.254: U7.62 19.15,59.64 19.6,60.09 22.3,60.09 | U8.4 22.35,60.14 22.3,60.09 | 22.3,60.09 23.75,60.09 R4.1
EECS
  Top 0.254: U7.63 18.65,61.64 19.1,62.09 21.4,62.09 | 21.4,62.09 24.8,62.09 25.1,61.79 R3.1 | 21.4,62.09 U8.5
EEDATA
  Top 0.254: U7.61 19.65,59.24 20,59.59 22,59.59 22.35,59.24 U8.3 22.35,58.44 22.2,58.29 22.2,56.73 R6.2
FLASH_CS#  (via drill 0.3)
  Top 0.127: U4.V3 47,33.49 47,34.09 47.2,34.29 47.7,34.29 47.9,34.09 v54.5,34.09 | v54.5,37.94 v54.49,37.95
  Top 0.203: v54.49,37.95 U2.1 | R30.1 54.5,33.19 v54.5,34.09
  Bottom 0.203: v54.5,34.09 v54.5,37.94
FLASH_MISO2
  Top 0.127: U4.T14 46.2,41.49 46.8,41.49 47,41.29 47,40.89 47.2,40.69 47.7,40.69 48.1,41.09 56.8,41.09 57.03,40.85 U2.3 57.03,38.05 57.2,37.89 60.1,37.89 60.34,38.13 R31.1
FLASH_MISO3
  Top 0.127: 55.76,46.25 U2.7 55.77,42.05 55.6,41.89 52.75,41.89 | U4.V14 52.75,41.89 | 52.75,41.89 R32.1
FLASH_MISO_MISO1
  Top 0.127: U4.R13 45.4,40.69 45.4,40.09 45.6,39.89 47.8,39.89 48,40.09 48,40.49 48.3,40.79 55.6,40.79 55.77,40.62 U2.2
FLASH_MOSI_MISO0  (via drill 0.2, 0.3)
  Top 0.127: v45.4,41.49 U4.T13
  Top 0.203: v59.3,46.09 58.36,46.09
  Top 0.254: 58.36,46.09 U2.5
  Bottom 0.127: v45.4,41.49 59,41.49 59.3,41.79 v59.3,46.09
FLASH_SCK
  Top 0.127: U2.6 57.03,41.62 56.9,41.49 47.2,41.49 47,41.69 47,42.89 46.8,43.09 45.4,43.09 U4.R15
FPGA_SCL  (via drill 0.2, 0.3)
  Top 0.127: U4.V9 v48.5,37.89 | 55.8,31.89 55.87,31.82
  Top 0.203: v55.8,34.09 55.8,31.89 55.8,30.39 55.95,30.25 R18.2 | 55.87,31.82 U11.3
  Bottom 0.203: v48.5,37.89 50.6,37.89 51.3,38.59 55.6,38.59 55.8,38.39 v55.8,34.09
FPGA_SDA  (via drill 0.2, 0.3)
  Top 0.127: U4.T9 v46.2,38.29
  Top 0.178: U11.4 57.38,31.34
  Top 0.203: v56.4,31.29 56.47,31.32 U11.4 57.1,31.32 R19.2
  Bottom 0.203: v46.2,38.29 46.6,38.69 50.35,38.69 50.75,39.09 56.2,39.09 56.4,38.89 v56.4,31.29
GND  (via drill 0.2, 0.3)
  Top 0.127: R27.2 49.66,22.73 v49.6,22.79 | R29.2 v54.1,19.19 | v63.8,38.29 J4.2 v66.57,38.29 | v63.8,36.79 J4.5 v66.57,36.79 | v63.8,35.29 J4.8 v66.57,35.29 | v63.8,33.79 J4.11 v66.57,33.79 | v63.8,32.29 J4.14 v66.57,32.29 | v63.8,30.79 J4.17 v66.57,30.79 | U1.2 v48.65,39.89 | C34.2 v66.34,23.49
  Top 0.178: R22.1 v63.94,20.54
  Top 0.203: U7.35 28.59,45.34 C8.2 | v14.8,41.09 C28.2 | C20.2 v57.1,33.89 57.1,32.9 U11.1 | v22.15,41.34 U7.25 | U7.47 v28.6,51.34 | C30.2 C6.2 v29.41,51.9 v29.4,51.89 | 24.59,55.25 24.65,55.3 v24.65,56.04 | C13.2 13.14,49.69 14.75,49.69 14.9,49.84 U7.5 v17.25,49.84 | U7.1 v16.2,52.34 | C31.2 5.47,41.24 v3.55,41.24 LED5.- | J8.6 v3.45,34.24 2.45,34.24 | 2.45,34.24 J8.GND3 | J8.GND1 2.45,25.09 2.45,34.24 | T1.2 v60,26.69
  Top 0.254: J7.GND 7.05,46.35 | U4.G2 v38.2,31.89 | U4.J4 v39.8,33.49 | U4.V1 v47,31.89 | U4.M2 v42.2,32.69 | U4.R1 v44.6,31.89 | U4.R4 v45.4,33.49 | U4.U6 v46.2,35.09 | v38.2,34.29 U4.G5 | 33.3,29.09 33.55,29.09 C22.2 33.55,28.19 v32.65,28.19 | 33.3,29.09 v32.65,29.09 | U7.51 24.65,55.18 24.59,55.25 C27.2 | U8.2 v21.4,57.39 | LED7.- v2.35,56.84 | U2.4 58.41,39.38 v59.2,39.39 | C14.2 C15.2 12.54,46.23 12.8,46.49 C5.2 13.35,46.63 13.95,47.34 U7.10 | U7.10 U7.11 | U7.10 v17.3,47.34 | U7.13 v17.3,45.84 | U7.15 v17.3,44.84 | C12.2 C13.2 | v13.1,53.89 C10.2 | C7.2 v18,57.59 | C9.2 17.2,61.05 v17.2,60.09 | v35.8,34.29 U4.D5 | U4.B7 v35,36.69 | U4.D10 v35.8,39.09 | U4.C3 v35,32.69 | U4.A1 33.3,30.99 33.3,29.09 | U4.B13 v35,41.49 | v46.2,40.69 U4.U12 | U4.R14 v45.4,42.29 | U4.L11 v42.2,39.89 | U4.N12 v43.8,40.69 | U4.G12 v38.2,39.89 | U4.J15 v40.6,43.09 | U4.G17 v39,44.69 | U4.E15 v36.6,43.09 | U4.C16 v35.8,43.89 | U4.A18 v33.4,45.49 | U4.M17 v43,44.69 | v46.2,43.89 U4.T16 | U4.R18 v45.4,45.49 | U4.V18 v47.8,45.49 | U4.R9 v45.4,38.29 | U4.M6 v43,35.89 | 30.5,45.14 C32.2 31.5,45.14 v31.5,46.29 | 30.5,45.14 v30.5,46.29 | v49.8,47.59 49.8,46.54 C26.2 50.8,46.54 v50.8,47.59 | U4.K10 v40.6,38.29 U4.J9 v39.8,37.49 U4.H8 | U4.K8 v41.4,37.49 | v40.6,39.09 U4.J11 | U4.L9 v42.2,37.49 | U4.H10 v39,38.29 | v43,41.49 U4.N13 | R2.1 v16.2,55.94 | C8.2 30.2,44.84 30.5,45.14 | C35.2 v57.6,24.59 56.16,24.59 C37.2 C40.2 | J5.SLEEVE v71.14,22.29 | C36.2 v56.9,26.69 | v45.6,24.59 44.66,24.59 C38.2 C39.2 | LED2.- 69.85,45.84 | 69.85,45.84 LED1.- | 31.4,18.89 C1.2 | C19.2 52.85,39.64 v53.55,39.64 | R34.1 v2.9,55.19 | LED3.- 3.7,19.69 | 3.7,19.69 LED4.- | 69.85,45.84 v70.7,45.84 | 3.7,19.69 v2.85,19.69
  Top 0.305: 7.05,46.35 v7.05,45.59 | U3.1 5.9,55.5 v5.9,57.69 | U10.1 27.21,25.99 31.4,25.99 | 31.4,25.99 v32.65,25.99 | C21.2 v9.5,50.24 | U6.1 27.2,18.89 31.4,18.89 v32.65,18.89 | 31.4,25.99 C11.2 | C17.2 v67.54,20.54
  Bottom 0.203: U5.2 38.9,48.64 v38.9,50.24 C33.2
  Bottom 0.254: U9.A3 v51.6,27.39 | U9.A1 v53.6,26.99 | U9.C1 v53.6,25.39 | U9.E1 v53.6,23.79 | U9.F1 v53.6,22.99 | v45.6,26.19 U9.B9 | v45.6,24.59 U9.D9 | U9.K1 v53.1,20.09 | C23.2 45.2,39.09 45.4,38.89 v45.4,38.29 45.4,37.69 45.2,37.49 C16.2 | C24.2 37.4,35.09 v38.2,34.29 | C4.2 42.76,41.73 v43,41.49 | C29.2 48.45,34.94 48.2,35.19 46.3,35.19 v46.2,35.09 | C42.2 46.76,33.23 46.5,33.49 v45.4,33.49 | C2.2 45.74,43.44 v46.2,43.89 | C3.2 46.76,40.44 46.5,40.69 v46.2,40.69 | C18.2 v35.8,34.29 | C25.2 43.34,35.55 v43,35.89
  pour Route2: 0,0 0,68.58 73.66,68.58 73.66,0
HDMI_DET#  (via drill 0.2, 0.3)
  Top 0.127: v45.4,36.69 U4.R8
  Top 0.203: T1.3 57.9,27.29 57.7,27.49 55.5,27.49 55.2,27.79 55.2,31.89 | v55.2,33.64 55.2,31.89 | 55.2,31.89 R17.2
  Bottom 0.127: v45.4,36.69 45.8,37.09 53.8,37.09 54,36.89 54,33.84 54.2,33.64 v55.2,33.64
INIT_B
  Top 0.127: U4.U3 47,32.69 47.8,32.69 48.3,33.19 R8.2
LED1  (via drill 0.2, 0.3)
  Top 0.127: U4.V16 v47.8,43.89
  Top 0.254: v63.05,44.69 R15.2
  Bottom 0.127: v47.8,43.89 47.4,44.29 47.4,46.39 47.6,46.59 60.7,46.59 61,46.29 61,44.89 61.2,44.69 v63.05,44.69
LED2  (via drill 0.2, 0.3)
  Top 0.127: U4.U16 v47,43.89
  Top 0.254: v63.05,46.89 R21.2
  Bottom 0.127: v47,43.89 47,46.69 47.2,46.89 v63.05,46.89
LED3  (via drill 0.3)
  Top 0.127: U4.A16 28,43.49 27.85,43.34 27.85,40.69 27.7,40.54 22.7,40.54 22.3,40.14 v15.95,40.14
  Top 0.254: v15.95,20.79 R10.2
  Bottom 0.254: v15.95,20.79 v15.95,40.14
LED4  (via drill 0.3)
  Top 0.127: U4.A15 33.4,43.09 28.35,43.09 28.15,42.89 28.15,40.44 27.95,40.24 22.95,40.24 22.3,39.59 v16.65,39.59
  Top 0.254: v16.55,18.59 R11.2
  Bottom 0.254: v16.55,18.59 v16.65,39.59
LED5
  Top 0.203: R33.2 4.05,38.38 4.45,37.99 12.3,37.99 12.6,38.29 12.6,38.74 12.85,38.99 22.4,38.99 23.2,39.79 32.1,39.79 32.6,40.29 U4.A12
LPDDR_A0  (via drill 0.2)
  Top 0.127: v39.8,35.89 U4.J7
  Bottom 0.127: U9.J8 47,20.59 46.6,20.19 45.4,20.19 44.8,20.79 42.7,20.79 42.1,21.39 42.1,23.19 39.7,25.59 39.7,25.69 39.8,25.79 39.9,25.79 41.95,23.74 42.05,23.74 42.15,23.84 42.15,23.94 39.7,26.39 39.7,26.49 39.8,26.59 39.9,26.59 41.9,24.59 42,24.59 42.1,24.69 42.1,24.79 39.7,27.19 39.7,27.29 39.8,27.39 39.9,27.39 40.4,26.89 40.5,26.89 40.6,26.99 40.6,27.09 39.8,27.89 39.8,31.79 39.4,32.19 39.4,34.69 39.5,34.79 39.7,34.79 39.8,34.89 39.8,34.99 39.7,35.09 39.5,35.09 39.4,35.19 39.4,35.49 v39.8,35.89
LPDDR_A1  (via drill 0.2)
  Top 0.127: v40.6,35.89 U4.J6
  Bottom 0.127: U9.J9 45.4,20.59 44.9,21.09 42.8,21.09 42.6,21.29 42.6,24.79 40.8,26.59 40.8,26.69 40.9,26.79 41,26.79 42.65,25.14 42.75,25.14 42.85,25.24 42.85,25.34 40.1,28.09 40.1,28.19 40.2,28.29 40.3,28.29 42.7,25.89 42.8,25.89 42.9,25.99 42.9,26.09 40.2,28.79 40.2,28.89 40.3,28.99 40.4,28.99 41.6,27.79 41.7,27.79 41.8,27.89 41.8,27.99 40.2,29.59 40.2,31.89 39.9,32.19 39.9,32.99 40.2,33.29 U4.J6 v40.6,35.89
LPDDR_A2  (via drill 0.2)
  Top 0.127: v41.4,35.09 39.8,35.09 U4.H5
  Route3 0.127: v42.6,30.59 41.8,31.39 41.8,34.69 v41.4,35.09
  Bottom 0.127: U9.K7 48,19.49 48.1,19.39 48.5,19.39 48.6,19.49 48.6,19.79 48.7,19.89 48.8,19.89 48.9,19.79 49.1,19.79 49.2,19.89 49.2,23.09 49.3,23.19 49.7,23.19 49.8,23.29 49.8,24.59 49.9,24.69 50.1,24.69 50.2,24.79 50.2,24.89 50.1,24.99 49.9,24.99 49.8,25.09 49.8,25.19 49.9,25.29 50.1,25.29 50.2,25.39 50.2,25.49 50.1,25.59 49.9,25.59 49.8,25.69 49.8,25.79 49.9,25.89 50.1,25.89 50.2,25.99 50.2,26.09 50.1,26.19 49.9,26.19 49.8,26.29 49.8,26.39 49.9,26.49 50.1,26.49 50.2,26.59 50.2,26.69 50.1,26.79 49.9,26.79 49.8,26.89 49.8,26.99 49.9,27.09 50.1,27.09 50.2,27.19 50.2,27.29 50.1,27.39 49.9,27.39 49.8,27.49 49.8,27.59 49.9,27.69 50.1,27.69 50.2,27.79 50.2,27.89 50.1,27.99 49.9,27.99 49.8,28.09 49.8,28.19 49.9,28.29 50.7,28.29 50.8,28.39 50.8,28.49 50.7,28.59 49.9,28.59 49.8,28.69 49.8,28.79 49.9,28.89 51.1,28.89 51.2,28.99 51.2,29.09 51.1,29.19 49.7,29.19 49.4,28.89 48.65,28.89 48.55,28.99 48.55,29.09 48.65,29.19 48.9,29.19 49,29.29 49,29.39 48.9,29.49 48.4,29.49 48.3,29.59 48.3,29.69 48.4,29.79 48.6,29.79 48.7,29.89 48.7,30.49 48.6,30.59 v42.6,30.59
LPDDR_A3  (via drill 0.2)
  Top 0.127: v42.2,35.89 U4.L7
  Route3 0.127: v42.9,30.19 42.3,30.19 41.4,31.09 41.4,32.89 41,33.29 41,36.09 41.2,36.29 U4.L7 v42.2,35.89
  Bottom 0.127: U9.K8 47.4,19.79 47.8,20.19 48.6,20.19 48.8,20.39 48.8,23.39 48.9,23.49 49.4,23.49 49.5,23.59 49.5,23.69 49.4,23.79 48.9,23.79 48.8,23.89 48.8,23.99 48.9,24.09 49.4,24.09 49.5,24.19 49.5,24.29 49.4,24.39 48.9,24.39 48.8,24.49 48.8,24.59 48.9,24.69 49.4,24.69 49.5,24.79 49.5,24.89 49.4,24.99 48.9,24.99 48.8,25.09 48.8,25.19 48.9,25.29 49.4,25.29 49.5,25.39 49.5,25.49 49.4,25.59 48.9,25.59 48.8,25.69 48.8,25.79 48.9,25.89 49.4,25.89 49.5,25.99 49.5,26.09 49.4,26.19 48.9,26.19 48.8,26.29 48.8,26.39 48.9,26.49 49.4,26.49 49.5,26.59 49.5,26.69 49.4,26.79 48.9,26.79 48.8,26.89 48.8,26.99 48.9,27.09 49.4,27.09 49.5,27.19 49.5,27.29 49.4,27.39 48.9,27.39 48.8,27.49 48.8,27.59 48.9,27.69 49.4,27.69 49.5,27.79 49.5,27.89 49.4,27.99 48.9,27.99 48.8,28.09 48.8,28.19 48.9,28.29 49.4,28.29 49.5,28.39 49.5,28.49 49.4,28.59 48.5,28.59 47.6,29.49 47.6,29.69 47.7,29.79 47.8,29.79 47.9,29.89 47.9,30.09 47.8,30.19 v42.9,30.19
LPDDR_A4  (via drill 0.2)
  Top 0.127: v36.6,32.69 37.4,32.69 U4.F3
  Bottom 0.127: U9.K2 52,18.39 50.5,16.89 42.7,16.89 36.65,22.94 36.6,26.49 36.4,26.69 35.9,26.69 35.2,27.39 35.2,29.54 35.1,29.64 35,29.64 34.9,29.54 34.9,28.59 34.8,28.49 34.7,28.49 34.6,28.59 34.6,30.09 34.7,30.19 35.3,30.19 35.4,30.29 35.4,30.39 35.3,30.49 35,30.49 34.9,30.59 34.9,30.69 35,30.79 36,30.79 36.2,30.99 36.2,32.29 v36.6,32.69
LPDDR_A5  (via drill 0.2)
  Top 0.127: v39,34.29 U4.H4
  Route3 0.127: v36.6,34.29 36.8,34.29 38,35.49 39.2,35.49 39.4,35.29 39.4,34.69 v39,34.29
  Bottom 0.127: U9.K3 51.2,18.19 50.3,17.29 42.7,17.29 37,22.99 37,26.74 36.75,26.99 36.3,26.99 35.6,27.69 35.6,27.89 35.7,27.99 35.8,27.99 35.9,28.09 35.9,28.19 35.8,28.29 35.7,28.29 35.6,28.39 35.6,29.79 37,31.19 37,33.89 v36.6,34.29
LPDDR_A6  (via drill 0.2)
  Top 0.127: v39,32.69 U4.H3
  Bottom 0.127: U9.J1 54.5,20.59 54.7,20.79 54.7,29.99 54.3,30.39 50.3,30.39 50.1,30.59 50.1,33.59 49.8,33.89 43.6,33.89 43.4,34.09 43.4,34.49 43.2,34.69 42.8,34.69 42.6,34.89 42.6,36.09 42.4,36.29 41.2,36.29 40.8,36.69 39.6,36.69 39.2,36.29 38.8,36.29 38.6,36.09 38.6,33.29 39,32.89 v39,32.69
LPDDR_A7  (via drill 0.2)
  Top 0.127: v39,35.09 U4.H6
  Route3 0.127: v37.4,33.49 37.8,33.89 37.8,34.49 38,34.69 38.6,34.69 v39,35.09
  Bottom 0.127: U9.J2 51.6,20.99 51,20.99 50.8,20.79 50.8,18.39 50.1,17.69 42.7,17.69 37.4,22.99 37.4,27.09 37.2,27.29 36.5,27.29 36.3,27.49 36.3,28.49 36.2,28.59 36,28.59 35.9,28.69 35.9,28.79 36,28.89 36.25,28.89 36.35,28.99 36.35,29.09 36.25,29.19 36,29.19 35.9,29.29 35.9,29.39 36,29.49 36.85,29.49 36.95,29.59 36.95,29.69 36.85,29.79 36.55,29.79 36.45,29.89 36.45,30.04 37.4,30.99 v37.4,33.49
LPDDR_A8  (via drill 0.2)
  Top 0.127: U4.D2 35.8,31.89 35.8,31.29 35.4,30.89 35.4,26.29 36.7,24.99 36.7,23.94 37.15,23.49 37.15,21.14 38,20.29 48.1,20.29 48.2,20.19 48.2,19.49 48.3,19.39 48.4,19.39 48.5,19.49 48.5,20.19 48.6,20.29 48.7,20.29 48.8,20.19 48.8,19.49 48.9,19.39 49,19.39 49.1,19.49 49.1,20.19 49.2,20.29 49.3,20.29 49.4,20.19 49.4,19.49 49.5,19.39 49.6,19.39 49.7,19.49 49.7,20.19 49.8,20.29 49.9,20.29 50,20.19 50,19.49 50.1,19.39 50.2,19.39 50.3,19.49 50.3,20.19 50.4,20.29 50.5,20.29 50.6,20.19 50.6,19.49 50.7,19.39 50.8,19.39 50.9,19.49 50.9,20.19 51,20.29 51.1,20.29 51.2,20.19 51.2,19.49 51.3,19.39 51.5,19.39 51.6,19.49 v51.6,20.19
  Bottom 0.127: v51.6,20.19 U9.J3
LPDDR_A9  (via drill 0.2)
  Top 0.127: U4.D1 36.2,31.19 35.7,30.69 35.7,26.49 37,25.19 37.4,25.19 37.5,25.09 37.5,24.99 37.4,24.89 37.2,24.89 37.1,24.79 37.1,24.69 37.2,24.59 37.4,24.59 37.5,24.49 37.5,24.39 37.4,24.29 37.2,24.29 37.1,24.19 37.1,24.09 37.2,23.99 37.4,23.99 37.5,23.89 37.5,21.29 38.2,20.59 48.7,20.59 48.8,20.69 48.8,21.29 48.9,21.39 49,21.39 49.1,21.29 49.1,20.69 49.2,20.59 49.3,20.59 49.4,20.69 49.4,21.29 49.5,21.39 49.6,21.39 49.7,21.29 49.7,20.69 49.8,20.59 49.9,20.59 50,20.69 50,21.29 50.1,21.39 50.2,21.39 50.3,21.29 50.3,20.69 50.4,20.59 50.5,20.59 50.6,20.69 50.6,21.09 50.7,21.19 50.8,21.19 50.9,21.09 50.9,20.69 51,20.59 51.1,20.59 51.2,20.69 51.2,21.09 51.3,21.19 51.4,21.19 51.5,21.09 51.5,20.69 51.6,20.59 51.7,20.59 51.8,20.69 51.8,21.19 51.9,21.29 52,21.29 52.1,21.19 52.1,20.69 52.2,20.59 52.3,20.59 52.4,20.69 52.4,21.19 52.5,21.29 52.9,21.29 v53.2,20.99
  Bottom 0.127: v53.2,20.99 U9.H1
LPDDR_A10  (via drill 0.2)
  Top 0.127: v38.2,33.49 U4.F4
  Bottom 0.127: U9.J7 47.8,20.59 47.4,20.19 47,20.19 46.8,19.99 46.8,19.49 46.7,19.39 45.3,19.39 45.2,19.49 45.2,19.99 45.1,20.09 45,20.09 44.9,19.99 44.9,19.54 44.8,19.44 44.7,19.44 44.6,19.54 44.6,20.29 44.5,20.39 44.4,20.39 44.3,20.29 44.3,19.54 44.2,19.44 44.1,19.44 44,19.54 44,20.29 43.9,20.39 43.8,20.39 43.7,20.29 43.7,19.54 43.6,19.44 43.5,19.44 43.4,19.54 43.4,20.29 43.3,20.39 42.7,20.39 39.7,23.39 39.7,23.49 39.8,23.59 39.9,23.59 41.6,21.89 41.7,21.89 41.8,21.99 41.8,22.09 39.9,23.99 39.9,24.09 40,24.19 40.1,24.19 41.6,22.69 41.7,22.69 41.8,22.79 41.8,22.89 39.4,25.29 39.4,31.69 38.6,32.49 38.6,32.89 38.2,33.29 v38.2,33.49
LPDDR_A11  (via drill 0.2)
  Top 0.127: v35.8,32.69 U4.D3
  Bottom 0.127: U9.H2 52.4,20.99 52.4,18.19 50.7,16.49 42.7,16.49 36.2,22.99 36.2,25.89 34.7,27.39 34.25,27.39 34.15,27.49 34.15,27.59 34.25,27.69 34.75,27.69 34.85,27.79 34.85,27.89 34.75,27.99 34.25,27.99 34.15,28.09 34.15,30.89 34.35,31.09 35.6,31.09 35.8,31.29 v35.8,32.69
LPDDR_A12  (via drill 0.2)
  Top 0.127: v38.2,35.09 U4.G6
  Route3 0.127: v38.2,35.09 38,35.09 37.4,34.49 v37.4,34.29
  Bottom 0.127: U9.H3 50.8,21.39 50.4,20.99 50.4,18.59 49.9,18.09 42.8,18.09 37.8,23.09 37.8,27.39 37.6,27.59 36.8,27.59 36.7,27.69 36.7,27.89 36.8,27.99 37.1,27.99 37.2,28.09 37.2,28.19 37.1,28.29 36.75,28.29 36.65,28.39 36.65,28.49 36.75,28.59 37.2,28.59 37.3,28.69 37.3,28.79 37.2,28.89 36.8,28.89 36.7,28.99 36.7,29.09 36.8,29.19 37.2,29.19 37.3,29.29 37.3,29.69 37.4,29.79 38,29.79 38.1,29.89 38.1,29.99 38,30.09 37.35,30.09 37.25,30.19 37.25,30.29 37.35,30.39 38,30.39 38.1,30.49 38.1,30.59 37.8,30.89 37.8,33.89 v37.4,34.29
LPDDR_BA0  (via drill 0.2)
  Top 0.127: U4.F2 37.4,31.89 37.4,30.69 37.3,30.59 36.1,30.59 36,30.49 36,30.39 36.1,30.29 37.7,30.29 37.8,30.19 37.8,30.09 37.7,29.99 36.1,29.99 36,29.89 36,27.19 36.1,27.09 37.75,27.09 37.85,26.99 37.85,26.89 37.75,26.79 36.3,26.79 36.2,26.69 36.2,26.59 36.3,26.49 37.75,26.49 37.85,26.39 37.85,26.29 37.75,26.19 36.9,26.19 36.8,26.09 36.8,25.99 36.9,25.89 37.75,25.89 37.85,25.79 37.85,21.44 38.3,20.99 46.2,20.99 46.3,21.09 46.3,21.99 46.4,22.09 46.6,22.09 46.7,21.99 46.7,21.09 46.8,20.99 46.9,20.99 47,21.09 47,21.99 47.1,22.09 47.5,22.09 47.6,21.99 v47.6,20.99
  Bottom 0.127: v47.6,20.99 U9.H8
LPDDR_BA1  (via drill 0.2)
  Top 0.127: U4.F1 37.8,30.74 38.2,30.34 38.2,24.69 38.4,24.49 40.1,24.49 40.2,24.39 40.2,24.29 40.1,24.19 38.45,24.19 38.35,24.09 38.35,23.99 38.45,23.89 40.1,23.89 40.2,23.79 40.2,23.69 40.1,23.59 38.45,23.59 38.35,23.49 38.35,23.39 38.45,23.29 40.1,23.29 40.2,23.19 40.2,23.09 40.1,22.99 38.45,22.99 38.35,22.89 38.35,22.79 38.45,22.69 40.1,22.69 40.2,22.59 40.2,22.49 40.1,22.39 38.45,22.39 38.35,22.29 38.35,22.19 38.45,22.09 40.15,22.09 40.25,21.99 40.25,21.89 40.15,21.79 38.45,21.79 38.35,21.69 38.35,21.59 38.45,21.49 40.45,21.49 40.65,21.69 40.65,21.99 40.75,22.09 45.5,22.09 45.6,21.99 v45.6,21.39
  Bottom 0.127: v45.6,21.39 U9.H9
LPDDR_CAS#  (via drill 0.2)
  Top 0.127: v41.4,34.29 U4.K5
  Bottom 0.127: U9.G8 46.8,22.59 45.4,22.59 45.2,22.79 45.2,27.39 45.1,27.49 44.8,27.49 44.7,27.59 44.7,27.69 44.8,27.79 47.8,27.79 47.9,27.89 47.9,27.99 47.8,28.09 44,28.09 43.9,28.19 43.9,28.29 44,28.39 47.3,28.39 47.4,28.49 47.4,28.59 47.3,28.69 43.4,28.69 43.3,28.79 43.3,28.89 43.4,28.99 46.7,28.99 46.8,29.09 46.8,29.19 46.7,29.29 42.7,29.29 41,30.99 41,33.69 41.4,34.09 v41.4,34.29
LPDDR_CK_N  (via drill 0.2)
  Top 0.127: v38.2,31.09 U4.G1 | R28.2 50.8,22.09 v50.4,22.09
  Bottom 0.127: U9.G3 50.5,22.19 v50.4,22.09 50.3,22.09 50.2,22.19 50.1,22.19 49.9,21.99 49.9,18.99 49.5,18.59 43.2,18.59 40.9,20.89 40.7,20.89 40.6,20.99 40.6,21.19 40.5,21.29 40.3,21.29 40.2,21.39 40.2,21.59 40.1,21.69 39.9,21.69 39.8,21.79 39.8,21.99 39.7,22.09 39.5,22.09 39.4,22.19 39.4,22.39 39.3,22.49 39.1,22.49 39,22.59 39,22.79 38.9,22.89 38.7,22.89 38.6,22.99 38.6,23.19 38.4,23.39 38.4,24.09 38.5,24.19 39.2,24.19 39.3,24.29 39.3,24.39 39.2,24.49 38.6,24.49 38.5,24.59 38.5,24.69 38.6,24.79 38.6,24.99 38.5,25.09 38.5,25.29 38.6,25.39 38.6,25.59 38.5,25.69 38.5,25.89 38.6,25.99 38.6,26.19 38.5,26.29 38.5,26.49 38.6,26.59 38.6,26.79 38.5,26.89 38.5,27.09 38.6,27.19 38.6,27.39 38.5,27.49 38.5,27.69 38.6,27.79 38.6,27.99 38.5,28.09 38.5,28.29 38.6,28.39 38.6,28.59 38.5,28.69 38.5,28.89 38.6,28.99 38.6,29.19 38.5,29.29 38.5,29.49 38.6,29.59 38.6,29.79 38.5,29.89 38.5,30.09 38.6,30.19 38.6,30.39 38.5,30.49 38.5,30.69 38.6,30.79 38.6,31.19 38.5,31.29 38.3,31.29 38.2,31.19 v38.2,31.09
LPDDR_CK_P  (via drill 0.2)
  Top 0.127: v38.2,32.69 U4.G3 | R28.1 50.8,22.79 v50.4,22.79
  Bottom 0.127: U9.G2 51.6,22.59 50.6,22.59 v50.4,22.79 50.1,22.49 49.9,22.49 49.6,22.19 49.6,19.19 49.3,18.89 43.3,18.89 38.7,23.49 38.7,23.79 38.8,23.89 39.4,23.89 39.6,24.09 39.6,24.59 39.4,24.79 39,24.79 38.9,24.89 38.9,31.79 38.2,32.49 v38.2,32.69
LPDDR_CKE  (via drill 0.2)
  Top 0.127: U4.H7 v39,35.89 | R29.1 54.1,21.69 v53.6,22.19
  Bottom 0.127: U9.G1 v53.6,22.19 54.2,22.19 54.4,22.39 54.4,29.79 54.1,30.09 49.9,30.09 49.7,30.29 49.7,33.29 49.6,33.39 49.5,33.39 49.4,33.29 49.4,32.39 49.3,32.29 49.2,32.29 49.1,32.39 49.1,33.29 49,33.39 48.9,33.39 48.8,33.29 48.8,32.39 48.7,32.29 48.6,32.29 48.5,32.39 48.5,33.29 48.4,33.39 48.3,33.39 48.2,33.29 48.2,32.39 48.1,32.29 44.3,32.29 44.2,32.39 44.2,32.99 44.1,33.09 43.6,33.09 43.4,33.29 43.4,33.69 43.2,33.89 42.8,33.89 42.6,34.09 42.6,34.49 42.4,34.69 42,34.69 41.8,34.89 41.8,35.29 41.6,35.49 41.2,35.49 41,35.69 41,36.09 40.8,36.29 39.6,36.29 39.2,35.89 v39,35.89
LPDDR_CS#  (via drill 0.2)
  Top 0.127: v48.4,20.99 48.4,21.93 R27.1
  Bottom 0.127: U9.H7 v48.4,20.99
LPDDR_DQ0  (via drill 0.2)
  Top 0.127: U4.L2 42.2,31.89 42.2,30.09 42.3,29.99 42.5,29.99 42.8,29.69 43.6,29.69 43.9,29.39 43.9,29.19 44,29.09 44.2,29.09 44.5,28.79 44.5,28.69 44.6,28.59 47.9,28.59 48,28.49 48.1,28.49 48.2,28.59 48.3,28.59 48.4,28.49 48.4,28.39 48.5,28.29 48.6,28.29 48.7,28.39 48.7,28.49 48.8,28.59 48.9,28.59 49,28.49 49,28.09 48.9,27.99 48.3,27.99 48.2,27.89 48.2,27.79 48.3,27.69 49.2,27.69 49.3,27.59 49.3,27.49 49.2,27.39 48.1,27.39 48,27.29 48,27.19 48.1,27.09 49.2,27.09 49.3,26.99 49.3,26.89 49.2,26.79 48.2,26.79 48.1,26.69 48.1,26.59 48.2,26.49 49.2,26.49 49.3,26.39 49.3,25.69 49.2,25.59 49.1,25.59 49,25.69 49,26.09 48.9,26.19 48.15,26.19 47.75,26.59 v47.6,26.59
  Bottom 0.127: U9.B7 v47.6,26.59
LPDDR_DQ1  (via drill 0.2)
  Top 0.127: U4.L1 41.8,31.39 41.9,31.29 41.9,29.79 42,29.69 42.4,29.69 42.5,29.59 42.5,29.49 42.3,29.29 42.3,29.19 42.4,29.09 42.5,29.09 42.8,29.39 43.5,29.39 43.6,29.29 43.6,29.19 43.5,29.09 43.4,29.09 43.3,28.99 43.3,28.89 43.4,28.79 44.1,28.79 44.2,28.69 44.2,28.59 44.1,28.49 43.5,28.49 43.4,28.39 43.4,28.29 43.5,28.19 44.2,28.19 44.3,28.29 47.6,28.29 47.9,27.99 47.9,27.89 47.8,27.79 47.7,27.79 47.5,27.99 47.4,27.99 47.3,27.89 47.3,27.79 47.2,27.69 47.1,27.69 47,27.79 47,27.89 46.9,27.99 44.4,27.99 44.3,27.89 43.5,27.89 43.4,27.79 43.4,27.39 43.5,27.29 43.7,27.29 43.8,27.39 43.8,27.49 43.9,27.59 44,27.59 44.1,27.49 44.1,27.39 44.2,27.29 44.3,27.29 44.4,27.39 44.4,27.49 44.5,27.59 44.6,27.59 44.7,27.49 44.7,27.39 44.8,27.29 44.9,27.29 45,27.39 45,27.59 45.1,27.69 46.1,27.69 46.4,27.39 v46.8,27.39
  Bottom 0.127: v46.8,27.39 U9.A8
LPDDR_DQ2  (via drill 0.2)
  Top 0.127: U4.K2 40.6,31.89 40.6,31.19 41,30.79 41,29.79 40.9,29.69 39.8,29.69 39.7,29.59 39.7,29.49 39.8,29.39 40.6,29.39 40.7,29.29 40.7,29.19 40.6,29.09 39.8,29.09 39.7,28.99 39.7,28.89 39.8,28.79 40.6,28.79 40.7,28.69 40.7,28.59 40.6,28.49 39.8,28.49 39.7,28.39 39.7,28.29 39.8,28.19 40.6,28.19 40.7,28.09 40.7,27.99 40.6,27.89 39.8,27.89 39.7,27.79 39.7,27.69 39.8,27.59 40.6,27.59 40.7,27.49 40.7,27.39 40.6,27.29 39.8,27.29 39.7,27.19 39.7,26.99 39.8,26.89 40,26.89 40.2,26.69 40.2,26.39 40.3,26.29 44.9,26.29 45.4,25.79 v46.8,25.79
  Bottom 0.127: v46.8,25.79 U9.C8
LPDDR_DQ3  (via drill 0.2)
  Top 0.127: U4.K1 41,31.19 41.3,30.89 41.3,29.59 41,29.29 41,29.09 41.1,28.99 41.4,28.99 41.5,28.89 41.5,28.79 41.4,28.69 41.1,28.69 41,28.59 41,28.49 41.1,28.39 42.6,28.39 42.7,28.29 42.7,28.19 42.6,28.09 41.1,28.09 41,27.99 41,27.89 41.1,27.79 42.6,27.79 42.7,27.69 42.7,27.59 42.6,27.49 41.1,27.49 41,27.39 41,27.29 41.1,27.19 42.6,27.19 42.7,27.09 42.7,26.99 42.6,26.89 40.6,26.89 40.5,26.79 40.5,26.69 40.6,26.59 v46.8,26.59
  Bottom 0.127: v46.8,26.59 U9.B8
LPDDR_DQ4  (via drill 0.2)
  Top 0.127: U4.H2 39,31.89 39,31.09 38.5,30.59 38.5,24.99 38.7,24.79 40.4,24.79 40.6,24.59 40.6,22.69 40.8,22.49 46.9,22.49 47.5,23.09 47.5,23.29 47.7,23.49 48.1,23.49 48.3,23.69 48.3,24.79 48.1,24.99 v47.6,24.99
  Bottom 0.127: v47.6,24.99 U9.D7
LPDDR_DQ5  (via drill 0.2)
  Top 0.127: v47.6,25.79 47.2,25.39 47.2,24.79 47.4,24.59 47.8,24.59 48,24.39 48,23.89 47.9,23.79 47.5,23.79 47.1,23.39 47.1,23.19 46.9,22.99 46.2,22.99 45.8,23.39 45.4,23.39 44.9,22.89 41.7,22.89 41.6,22.99 41.6,23.49 41.5,23.59 41.4,23.59 41.3,23.49 41.3,22.99 41.2,22.89 41.1,22.89 41,22.99 41,24.69 40.5,25.19 39,25.19 38.8,25.39 38.8,30.39 39.4,30.99 U4.H1
  Bottom 0.127: v47.6,25.79 U9.C7
LPDDR_DQ6  (via drill 0.2)
  Top 0.127: U4.J3 39.8,32.69 39.8,30.89 39.1,30.19 39.1,25.79 39.3,25.59 40.5,25.59 41.3,24.79 41.3,23.99 41.4,23.89 41.5,23.89 41.6,23.99 41.6,24.59 41.7,24.69 41.8,24.69 41.9,24.59 41.9,23.39 42,23.29 42.1,23.29 42.2,23.39 42.2,23.99 42.3,24.09 42.4,24.09 42.5,23.99 42.5,23.49 42.6,23.39 44.9,23.39 45.1,23.59 45.1,24.09 45.2,24.19 46,24.19 46.2,23.99 46.2,23.49 46.3,23.39 46.7,23.39 46.8,23.49 v46.8,24.19
  Bottom 0.127: v46.8,24.19 U9.D8
LPDDR_DQ7  (via drill 0.2)
  Top 0.127: U4.J1 40.2,30.79 39.4,29.99 39.4,26.69 39.5,26.59 39.8,26.59 39.9,26.49 39.9,26.39 39.8,26.29 39.5,26.29 39.4,26.19 39.4,26.09 39.5,25.99 41,25.99 41.1,25.89 41.1,25.39 41.2,25.29 41.3,25.29 41.4,25.39 41.4,25.89 41.5,25.99 41.6,25.99 41.7,25.89 41.7,25.09 41.8,24.99 41.9,24.99 42,25.09 42,25.89 42.1,25.99 42.2,25.99 42.3,25.89 42.3,24.49 42.4,24.39 42.5,24.39 42.6,24.49 42.6,24.89 42.7,24.99 45.9,24.99 46,25.09 46,25.39 46.1,25.49 46.2,25.49 46.3,25.39 46.3,24.59 46.4,24.49 46.5,24.49 46.6,24.59 46.6,24.99 46.7,25.09 46.8,25.09 46.9,24.99 46.9,24.69 47.4,24.19 v47.6,24.19
  Bottom 0.127: v47.6,24.19 U9.E7
LPDDR_DQ8  (via drill 0.2)
  Top 0.127: U4.M3 v43,32.69
  Bottom 0.127: U9.D2 51.6,24.19 51,24.19 50.8,24.39 50.8,27.39 51.2,27.79 53.4,27.79 53.6,27.99 53.6,29.49 53.3,29.79 49.6,29.79 49.3,30.09 49.3,30.99 48.9,31.39 43.4,31.39 43,31.79 v43,32.69
LPDDR_DQ9  (via drill 0.2)
  Top 0.127: U4.M1 42.6,31.19 44.9,28.89 49.1,28.89 49.3,28.69 49.3,28.09 49.6,27.79 49.6,25.39 49.5,25.29 49,25.29 48.9,25.19 48.9,25.09 49,24.99 50,24.99 50.1,24.89 50.1,24.79 50,24.69 49,24.69 48.9,24.59 48.9,24.49 49,24.39 50.2,24.39 50.3,24.29 50.3,24.19 50.2,24.09 49,24.09 48.9,23.99 48.9,23.89 49,23.79 49.5,23.79 49.6,23.69 49.6,23.29 49.7,23.19 49.8,23.19 49.9,23.29 49.9,23.69 50,23.79 50.1,23.79 50.2,23.69 50.2,23.29 50.3,23.19 50.5,23.19 50.6,23.29 v50.6,23.79
  Bottom 0.127: v50.6,23.79 U9.E3
LPDDR_DQ10  (via drill 0.2)
  Top 0.127: U4.N2 43,31.89 43,31.19 45,29.19 49.4,29.19 49.7,28.89 49.7,28.19 49.9,27.99 49.9,25.69 50.4,25.19 50.4,24.69 51,24.09 51,23.74 51.1,23.64 51.5,23.64 51.6,23.54 51.6,22.79 51.8,22.59 52.6,22.59 52.9,22.89 52.9,23.19 53.1,23.39 v54,23.39
  Bottom 0.127: v54,23.39 54,24.79 53.8,24.99 52.4,24.99 U9.C2
LPDDR_DQ11  (via drill 0.2)
  Top 0.127: U4.N1 43.4,31.19 43.8,30.79 44.7,30.79 44.8,30.69 44.8,30.59 44.7,30.49 44.4,30.49 44.3,30.39 44.3,30.29 44.4,30.19 45.1,30.19 45.2,30.09 45.2,29.99 45.1,29.89 45,29.89 44.9,29.79 44.9,29.69 45,29.59 49.8,29.59 50,29.39 50,28.29 50.2,28.09 50.2,25.79 50.8,25.19 50.8,24.69 51.3,24.19 51.3,24.04 51.4,23.94 51.5,23.94 51.6,24.04 51.6,24.14 51.7,24.24 52.2,24.24 52.3,24.14 52.3,23.99 52.2,23.89 51.95,23.89 51.85,23.79 51.85,23.69 51.95,23.59 52.2,23.59 52.3,23.49 52.3,23.39 52.2,23.29 52,23.29 51.9,23.19 51.9,23.09 52,22.99 52.4,22.99 52.6,23.19 52.6,24.24 52.3,24.54 52.05,24.54 v51.6,24.99
  Bottom 0.127: v51.6,24.99 U9.D3
LPDDR_DQ12  (via drill 0.2)
  Top 0.127: U4.T2 45.4,31.89 45.4,30.69 45.9,30.19 50.3,30.19 50.6,29.89 50.6,28.69 50.8,28.49 50.8,26.19 51.3,25.69 51.5,25.69 51.7,25.89 51.9,25.89 52,25.79 52,25.59 52.1,25.49 52.2,25.49 52.3,25.59 52.3,25.99 52.4,26.09 52.5,26.09 52.6,25.99 52.6,25.19 52.7,25.09 53.1,25.09 53.2,25.19 53.2,25.29 53.1,25.39 53,25.39 52.9,25.49 52.9,26.99 53,27.09 53.1,27.09 53.2,26.99 53.2,25.99 53.4,25.79 v54,25.79
  Bottom 0.127: v54,25.79 51.6,25.79 U9.C3
LPDDR_DQ13  (via drill 0.2)
  Top 0.127: U4.T1 45.8,30.89 46.2,30.49 53.1,30.49 53.2,30.39 53.2,30.29 53.1,30.19 51,30.19 50.9,30.09 50.9,29.99 51,29.89 52.8,29.89 52.9,29.79 52.9,29.69 52.8,29.59 51,29.59 50.9,29.49 50.9,29.39 51,29.29 51.7,29.29 51.8,29.19 51.8,29.09 51.7,28.99 51.1,28.99 51,28.89 51,28.79 51.1,28.69 51.7,28.69 51.8,28.59 51.8,28.49 51.7,28.39 51.4,28.39 51.2,28.19 51.2,26.39 51.4,26.19 U9.B2 v52.4,26.59
  Bottom 0.127: U9.B2 v52.4,26.59
LPDDR_DQ14  (via drill 0.2)
  Top 0.127: U4.U2 46.2,31.89 46.2,31.19 46.6,30.79 54.3,30.79 54.4,30.69 54.4,29.59 54.3,29.49 54.2,29.49 54.1,29.59 54.1,30.39 54,30.49 53.9,30.49 53.8,30.39 53.8,29.59 53.7,29.49 53.6,29.49 53.5,29.59 53.5,29.79 53.4,29.89 53.3,29.89 53.2,29.79 53.2,29.49 53,29.29 53,29.09 52.9,28.99 52.1,28.99 52,28.89 52,28.79 52.1,28.69 53,28.69 53.1,28.59 53.1,28.49 53,28.39 52.1,28.39 52,28.29 52,28.19 52.1,28.09 53,28.09 53.1,27.99 53.1,27.89 53,27.79 52.2,27.79 52,27.59 52,26.99 v51.6,26.59
  Bottom 0.127: U9.B3 v51.6,26.59
LPDDR_DQ15  (via drill 0.2)
  Top 0.127: U4.U1 47,31.09 54.6,31.09 54.8,30.89 54.8,29.29 54.7,29.19 53.4,29.19 53.3,29.09 53.3,28.99 53.4,28.89 54.7,28.89 54.8,28.79 54.8,28.69 54.7,28.59 53.5,28.59 53.4,28.49 53.4,28.39 53.5,28.29 54.7,28.29 54.8,28.19 54.8,28.09 54.7,27.99 53.5,27.99 53.4,27.89 53.4,27.79 53.5,27.69 54.7,27.69 54.8,27.59 54.8,27.49 54.7,27.39 v52.4,27.39
  Bottom 0.127: v52.4,27.39 U9.A2
LPDDR_LDM  (via drill 0.2)